# EAGLE design shift_regs (EAGLE 6.1)

## Sheet 1 of 3
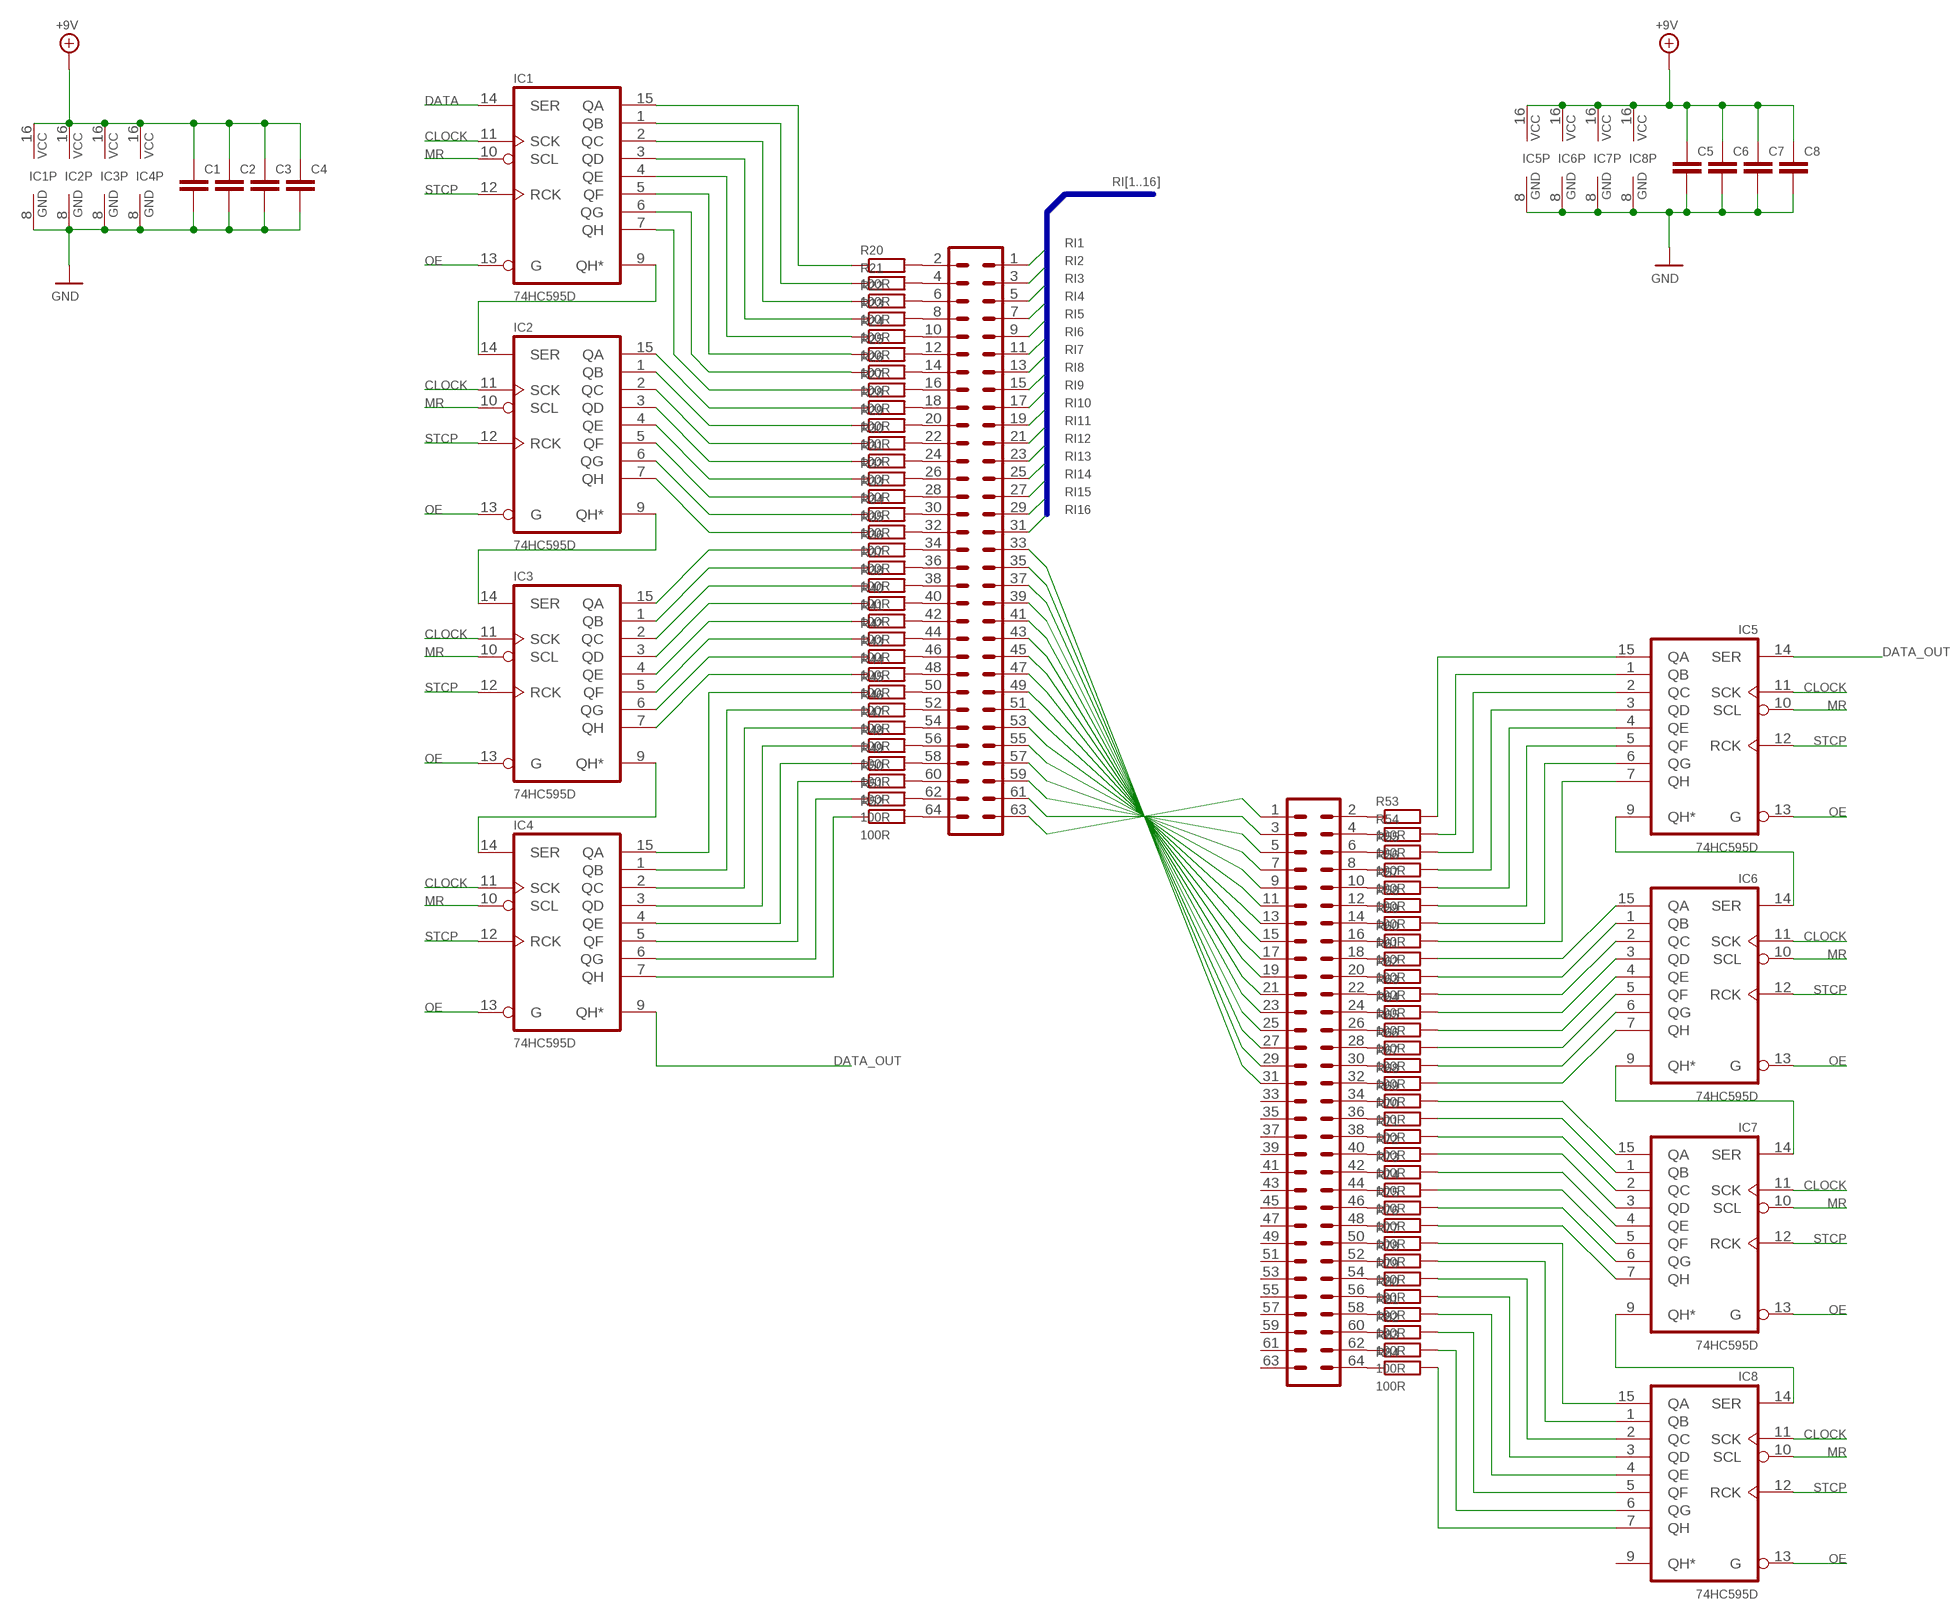
[diagram p0: schematic, sheet 1]

### Parts
C1  C-EUC0805  [C0805]
C2  C-EUC0805  [C0805]
C3  C-EUC0805  [C0805]
C4  C-EUC0805  [C0805]
C5  C-EUC0805  [C0805]
C6  C-EUC0805  [C0805]
C7  C-EUC0805  [C0805]
C8  C-EUC0805  [C0805]
IC1  74HC595D  [SO16]
IC2  74HC595D  [SO16]
IC3  74HC595D  [SO16]
IC4  74HC595D  [SO16]
IC5  74HC595D  [SO16]
IC6  74HC595D  [SO16]
IC7  74HC595D  [SO16]
IC8  74HC595D  [SO16]
R20  100R  R-EU_R0805  [R0805]
R21  100R  R-EU_R0805  [R0805]
R22  100R  R-EU_R0805  [R0805]
R23  100R  R-EU_R0805  [R0805]
R24  100R  R-EU_R0805  [R0805]
R25  100R  R-EU_R0805  [R0805]
R26  100R  R-EU_R0805  [R0805]
R27  100R  R-EU_R0805  [R0805]
R28  100R  R-EU_R0805  [R0805]
R29  100R  R-EU_R0805  [R0805]
R30  100R  R-EU_R0805  [R0805]
R31  100R  R-EU_R0805  [R0805]
R32  100R  R-EU_R0805  [R0805]
R33  100R  R-EU_R0805  [R0805]
R34  100R  R-EU_R0805  [R0805]
R35  100R  R-EU_R0805  [R0805]
R36  100R  R-EU_R0805  [R0805]
R37  100R  R-EU_R0805  [R0805]
R38  100R  R-EU_R0805  [R0805]
R40  100R  R-EU_R0805  [R0805]
R41  100R  R-EU_R0805  [R0805]
R42  100R  R-EU_R0805  [R0805]
R43  100R  R-EU_R0805  [R0805]
R44  100R  R-EU_R0805  [R0805]
R45  100R  R-EU_R0805  [R0805]
R46  100R  R-EU_R0805  [R0805]
R47  100R  R-EU_R0805  [R0805]
R48  100R  R-EU_R0805  [R0805]
R49  100R  R-EU_R0805  [R0805]
R50  100R  R-EU_R0805  [R0805]
R51  100R  R-EU_R0805  [R0805]
R52  100R  R-EU_R0805  [R0805]
R53  100R  R-EU_R0805  [R0805]
R54  100R  R-EU_R0805  [R0805]
R55  100R  R-EU_R0805  [R0805]
R56  100R  R-EU_R0805  [R0805]
R57  100R  R-EU_R0805  [R0805]
R58  100R  R-EU_R0805  [R0805]
R59  100R  R-EU_R0805  [R0805]
R60  100R  R-EU_R0805  [R0805]
R61  100R  R-EU_R0805  [R0805]
R62  100R  R-EU_R0805  [R0805]
R63  100R  R-EU_R0805  [R0805]
R64  100R  R-EU_R0805  [R0805]
R65  100R  R-EU_R0805  [R0805]
R66  100R  R-EU_R0805  [R0805]
R67  100R  R-EU_R0805  [R0805]
R68  100R  R-EU_R0805  [R0805]
R69  100R  R-EU_R0805  [R0805]
R70  100R  R-EU_R0805  [R0805]
R71  100R  R-EU_R0805  [R0805]
R72  100R  R-EU_R0805  [R0805]
R73  100R  R-EU_R0805  [R0805]
R74  100R  R-EU_R0805  [R0805]
R75  100R  R-EU_R0805  [R0805]
R76  100R  R-EU_R0805  [R0805]
R77  100R  R-EU_R0805  [R0805]
R78  100R  R-EU_R0805  [R0805]
R79  100R  R-EU_R0805  [R0805]
R80  100R  R-EU_R0805  [R0805]
R81  100R  R-EU_R0805  [R0805]
R82  100R  R-EU_R0805  [R0805]
R83  100R  R-EU_R0805  [R0805]
R84  100R  R-EU_R0805  [R0805]
SV1  ML64  [ML64]
SV2  ML64  [ML64]

### Nets
+9V: C1.1 C2.1 C3.1 C4.1 C5.1 C6.1 C7.1 C8.1 IC1.16(VCC) IC2.16(VCC) IC3.16(VCC) IC4.16(VCC) IC5.16(VCC) IC6.16(VCC) IC7.16(VCC) IC8.16(VCC) ; also sheet 3
CLOCK: IC1.11(SCK) IC2.11(SCK) IC3.11(SCK) IC4.11(SCK) IC5.11(SCK) IC6.11(SCK) IC7.11(SCK) IC8.11(SCK) ; also sheet 3
DATA: IC1.14(SER) ; also sheet 3
DATA_OUT: IC4.9(QH*) IC5.14(SER)
GND: C1.2 C2.2 C3.2 C4.2 C5.2 C6.2 C7.2 C8.2 IC1.8(GND) IC2.8(GND) IC3.8(GND) IC4.8(GND) IC5.8(GND) IC6.8(GND) IC7.8(GND) IC8.8(GND) ; also sheet 2,3
MR: IC1.10(SCL) IC2.10(SCL) IC3.10(SCL) IC4.10(SCL) IC5.10(SCL) IC6.10(SCL) IC7.10(SCL) IC8.10(SCL) ; also sheet 3
N$1: IC1.9(QH*) IC2.14(SER)
N$2: IC2.9(QH*) IC3.14(SER)
N$3: IC3.9(QH*) IC4.14(SER)
N$5: IC1.1(QB) R21.1
N$6: IC1.2(QC) R22.1
N$7: IC1.3(QD) R23.1
N$8: IC1.4(QE) R24.1
N$9: IC1.5(QF) R25.1
N$10: IC1.6(QG) R26.1
N$11: IC1.7(QH) R27.1
N$12: IC1.15(QA) R20.1
N$13: IC2.1(QB) R29.1
N$14: IC2.2(QC) R30.1
N$15: IC2.3(QD) R31.1
N$16: IC2.4(QE) R32.1
N$17: IC2.5(QF) R33.1
N$18: IC2.6(QG) R34.1
N$19: IC2.7(QH) R35.1
N$20: IC2.15(QA) R28.1
N$21: IC3.1(QB) R37.1
N$22: IC3.2(QC) R38.1
N$23: IC3.3(QD) R40.1
N$24: IC3.4(QE) R41.1
N$25: IC3.5(QF) R42.1
N$26: IC3.6(QG) R43.1
N$27: IC3.7(QH) R44.1
N$28: IC3.15(QA) R36.1
N$29: R20.2 SV1.2
N$30: R21.2 SV1.4
N$31: R22.2 SV1.6
N$32: R23.2 SV1.8
N$33: R24.2 SV1.10
N$34: R25.2 SV1.12
N$35: R26.2 SV1.14
N$36: R27.2 SV1.16
N$37: IC5.9(QH*) IC6.14(SER)
N$38: IC6.9(QH*) IC7.14(SER)
N$39: IC7.9(QH*) IC8.14(SER)
N$40: IC5.1(QB) R54.2
N$41: IC5.2(QC) R55.2
N$42: IC5.3(QD) R56.2
N$43: IC5.4(QE) R57.2
N$44: IC5.5(QF) R58.2
N$45: IC5.6(QG) R59.2
N$46: IC5.7(QH) R60.2
N$47: IC5.15(QA) R53.2
N$48: IC6.1(QB) R62.2
N$49: IC6.2(QC) R63.2
N$50: IC6.3(QD) R64.2
N$51: IC6.4(QE) R65.2
N$52: IC6.5(QF) R66.2
N$53: IC6.6(QG) R67.2
N$54: IC6.7(QH) R68.2
N$55: IC6.15(QA) R61.2
N$56: IC7.1(QB) R70.2
N$57: IC7.2(QC) R71.2
N$58: IC7.3(QD) R72.2
N$59: IC7.4(QE) R73.2
N$60: IC7.5(QF) R74.2
N$61: IC7.6(QG) R75.2
N$62: IC7.7(QH) R76.2
N$63: IC7.15(QA) R69.2
N$64: IC8.15(QA) R77.2
N$65: IC8.1(QB) R78.2
N$66: IC8.2(QC) R79.2
N$67: IC8.3(QD) R80.2
N$68: IC8.4(QE) R81.2
N$69: IC8.5(QF) R82.2
N$70: IC8.6(QG) R83.2
N$71: IC8.7(QH) R84.2
N$72: SV1.63 SV2.1
N$73: SV1.61 SV2.3
N$74: SV1.59 SV2.5
N$75: SV1.57 SV2.7
N$76: SV1.55 SV2.9
N$77: SV1.53 SV2.11
N$78: SV1.51 SV2.13
N$79: SV1.49 SV2.15
N$80: SV1.47 SV2.17
N$81: SV1.45 SV2.19
N$82: SV1.43 SV2.21
N$83: SV1.41 SV2.23
N$84: SV1.39 SV2.25
N$85: SV1.37 SV2.27
N$86: SV1.35 SV2.29
N$87: SV1.33 SV2.31
N$92: R28.2 SV1.18
N$93: R29.2 SV1.20
N$94: R30.2 SV1.22
N$95: R31.2 SV1.24
N$96: R32.2 SV1.26
N$97: R33.2 SV1.28
N$98: R34.2 SV1.30
N$99: R35.2 SV1.32
N$100: R36.2 SV1.34
N$101: R37.2 SV1.36
N$102: R38.2 SV1.38
N$103: R40.2 SV1.40
N$104: R41.2 SV1.42
N$105: R42.2 SV1.44
N$106: R43.2 SV1.46
N$107: R44.2 SV1.48
N$108: R45.2 SV1.50
N$109: R46.2 SV1.52
N$110: R47.2 SV1.54
N$111: R48.2 SV1.56
N$112: R49.2 SV1.58
N$113: R50.2 SV1.60
N$114: R51.2 SV1.62
N$115: R52.2 SV1.64
N$116: R53.1 SV2.2
N$117: R54.1 SV2.4
N$118: R55.1 SV2.6
N$119: IC4.15(QA) R45.1
N$120: IC4.1(QB) R46.1
N$121: IC4.2(QC) R47.1
N$122: IC4.3(QD) R48.1
N$123: IC4.4(QE) R49.1
N$124: IC4.5(QF) R50.1
N$125: IC4.6(QG) R51.1
N$126: IC4.7(QH) R52.1
N$127: R56.1 SV2.8
N$128: R57.1 SV2.10
N$129: R58.1 SV2.12
N$130: R59.1 SV2.14
N$131: R60.1 SV2.16
N$132: R61.1 SV2.18
N$133: R62.1 SV2.20
N$134: R63.1 SV2.22
N$135: R64.1 SV2.24
N$136: R65.1 SV2.26
N$137: R66.1 SV2.28
N$138: R67.1 SV2.30
N$158: R68.1 SV2.32
N$159: R69.1 SV2.34
N$160: R70.1 SV2.36
N$161: R71.1 SV2.38
N$162: R72.1 SV2.40
N$163: R73.1 SV2.42
N$164: R74.1 SV2.44
N$165: R75.1 SV2.46
N$166: R76.1 SV2.48
N$167: R77.1 SV2.50
N$168: R78.1 SV2.52
N$169: R79.1 SV2.54
N$170: R80.1 SV2.56
N$171: R81.1 SV2.58
N$172: R82.1 SV2.60
N$173: R83.1 SV2.62
N$174: R84.1 SV2.64
OE: IC1.13(G) IC2.13(G) IC3.13(G) IC4.13(G) IC5.13(G) IC6.13(G) IC7.13(G) IC8.13(G) ; also sheet 3
RI1: SV1.1 ; also sheet 2
RI2: SV1.3 ; also sheet 2
RI3: SV1.5 ; also sheet 2
RI4: SV1.7 ; also sheet 2
RI5: SV1.9 ; also sheet 2
RI6: SV1.11 ; also sheet 2
RI7: SV1.13 ; also sheet 2
RI8: SV1.15 ; also sheet 2
RI9: SV1.17 ; also sheet 2
RI10: SV1.19 ; also sheet 2
RI11: SV1.21 ; also sheet 2
RI12: SV1.23 ; also sheet 2
RI13: SV1.25 ; also sheet 2
RI14: SV1.27 ; also sheet 2
RI15: SV1.29 ; also sheet 2
RI16: SV1.31 ; also sheet 2
STCP: IC1.12(RCK) IC2.12(RCK) IC3.12(RCK) IC4.12(RCK) IC5.12(RCK) IC6.12(RCK) IC7.12(RCK) IC8.12(RCK) ; also sheet 3
Unconnected: IC8.9(QH*) SV2.33 SV2.35 SV2.37 SV2.39 SV2.41 SV2.43 SV2.45 SV2.47 SV2.49 SV2.51 SV2.53 SV2.55 SV2.57 SV2.59 SV2.61 SV2.63

### Buses
RI[1..16]

## Sheet 2 of 3
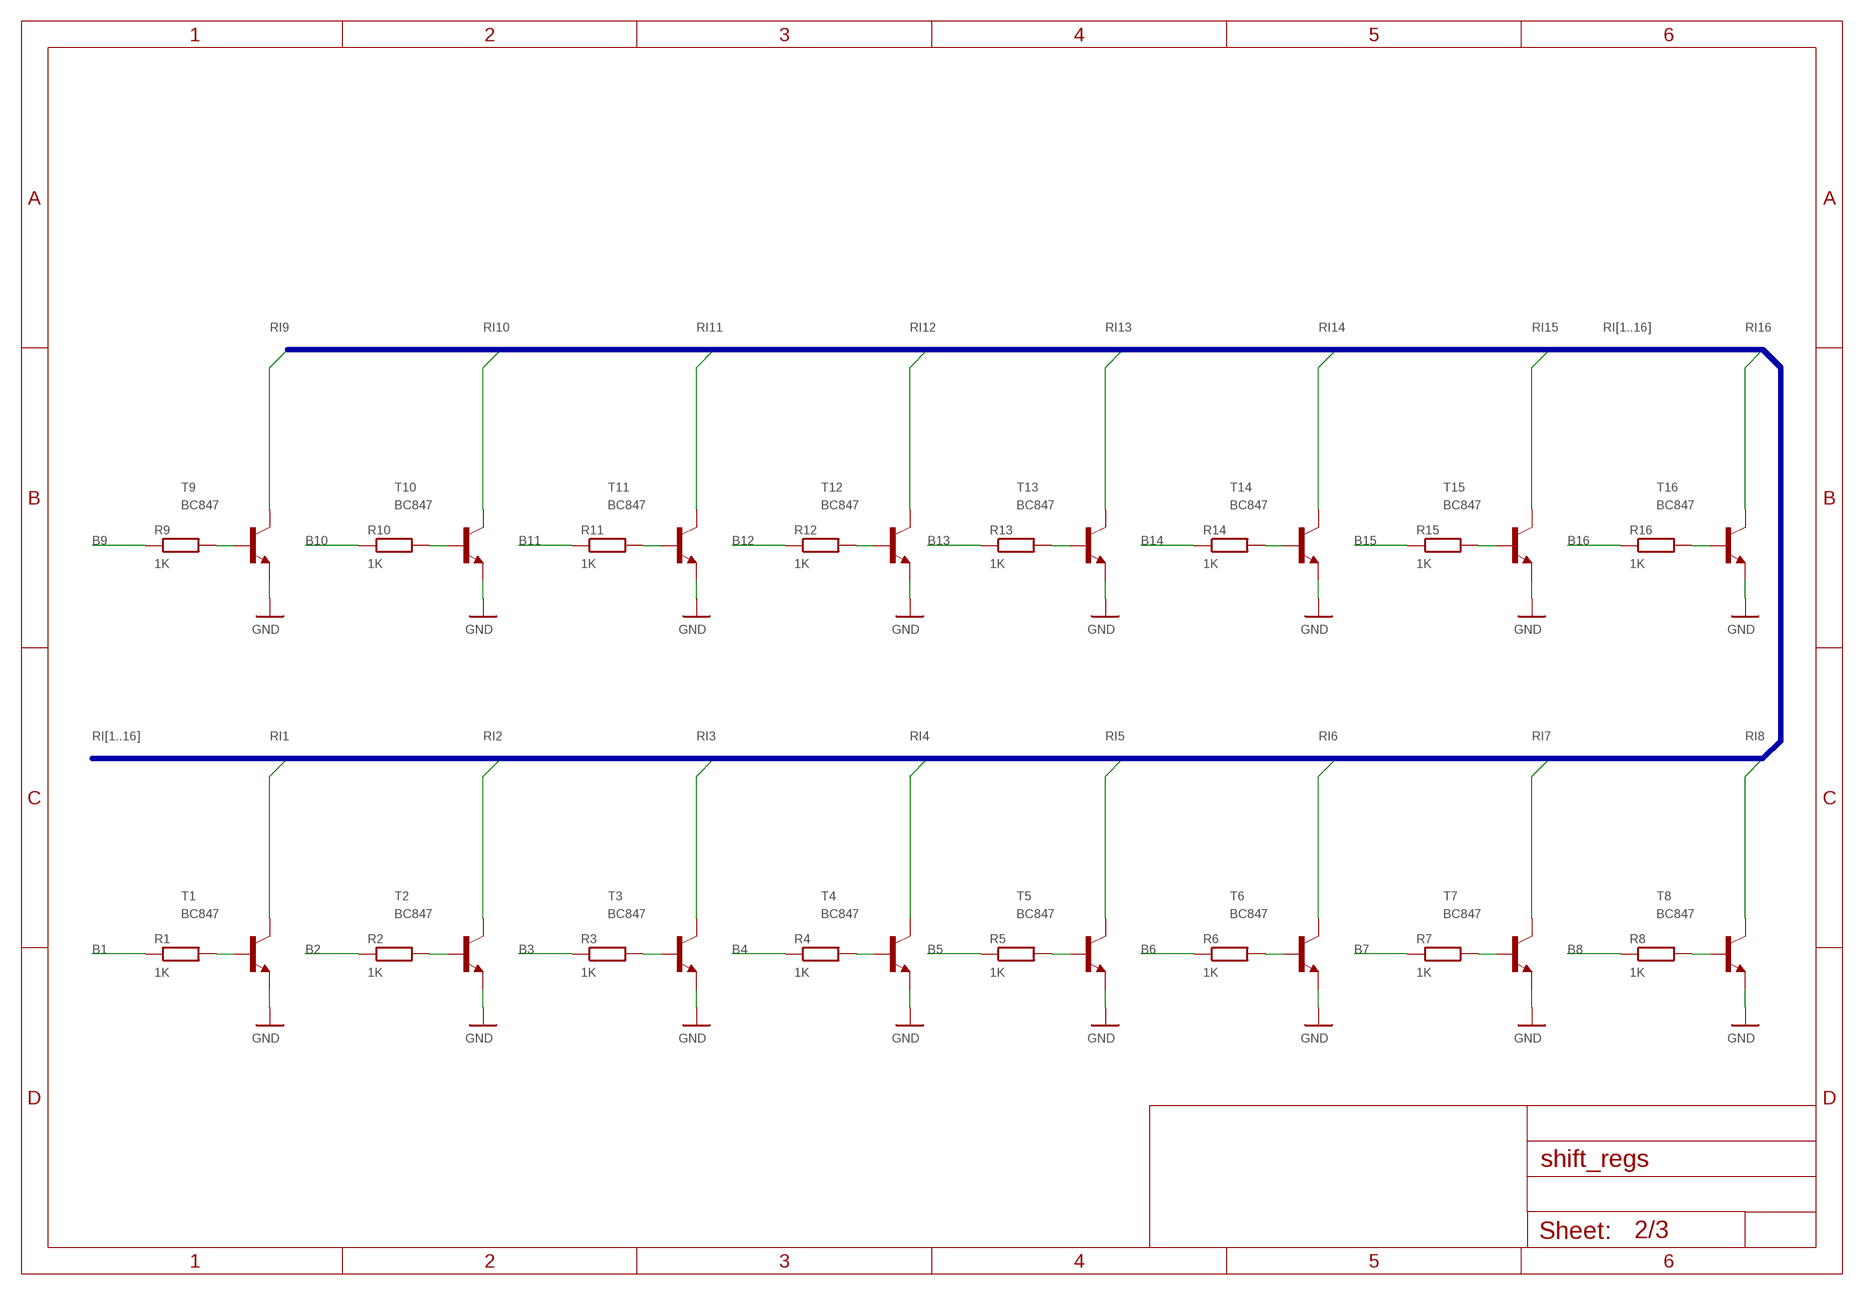
[diagram p1: schematic, sheet 2]

### Parts
R1  1K  R-EU_R0805  [R0805]
R2  1K  R-EU_R0805  [R0805]
R3  1K  R-EU_R0805  [R0805]
R4  1K  R-EU_R0805  [R0805]
R5  1K  R-EU_R0805  [R0805]
R6  1K  R-EU_R0805  [R0805]
R7  1K  R-EU_R0805  [R0805]
R8  1K  R-EU_R0805  [R0805]
R9  1K  R-EU_R0805  [R0805]
R10  1K  R-EU_R0805  [R0805]
R11  1K  R-EU_R0805  [R0805]
R12  1K  R-EU_R0805  [R0805]
R13  1K  R-EU_R0805  [R0805]
R14  1K  R-EU_R0805  [R0805]
R15  1K  R-EU_R0805  [R0805]
R16  1K  R-EU_R0805  [R0805]
T1  BC847  [SOT23]
T2  BC847  [SOT23]
T3  BC847  [SOT23]
T4  BC847  [SOT23]
T5  BC847  [SOT23]
T6  BC847  [SOT23]
T7  BC847  [SOT23]
T8  BC847  [SOT23]
T9  BC847  [SOT23]
T10  BC847  [SOT23]
T11  BC847  [SOT23]
T12  BC847  [SOT23]
T13  BC847  [SOT23]
T14  BC847  [SOT23]
T15  BC847  [SOT23]
T16  BC847  [SOT23]

### Nets
B1: R1.1 ; also sheet 3
B2: R2.1 ; also sheet 3
B3: R3.1 ; also sheet 3
B4: R4.1 ; also sheet 3
B5: R5.1 ; also sheet 3
B6: R6.1 ; also sheet 3
B7: R7.1 ; also sheet 3
B8: R8.1 ; also sheet 3
B9: R9.1 ; also sheet 3
B10: R10.1 ; also sheet 3
B11: R11.1 ; also sheet 3
B12: R12.1 ; also sheet 3
B13: R13.1 ; also sheet 3
B14: R14.1 ; also sheet 3
B15: R15.1 ; also sheet 3
B16: R16.1 ; also sheet 3
GND: T1.2(E) T2.2(E) T3.2(E) T4.2(E) T5.2(E) T6.2(E) T7.2(E) T8.2(E) T9.2(E) T10.2(E) T11.2(E) T12.2(E) T13.2(E) T14.2(E) T15.2(E) T16.2(E) ; also sheet 1,3
N$139: R1.2 T1.1(B)
N$141: R2.2 T2.1(B)
N$142: R3.2 T3.1(B)
N$143: R4.2 T4.1(B)
N$144: R5.2 T5.1(B)
N$145: R6.2 T6.1(B)
N$146: R7.2 T7.1(B)
N$147: R8.2 T8.1(B)
N$148: R9.2 T9.1(B)
N$149: R10.2 T10.1(B)
N$150: R11.2 T11.1(B)
N$151: R12.2 T12.1(B)
N$152: R13.2 T13.1(B)
N$153: R14.2 T14.1(B)
N$154: R15.2 T15.1(B)
N$155: R16.2 T16.1(B)
RI1: T1.3(C) ; also sheet 1
RI2: T2.3(C) ; also sheet 1
RI3: T3.3(C) ; also sheet 1
RI4: T4.3(C) ; also sheet 1
RI5: T5.3(C) ; also sheet 1
RI6: T6.3(C) ; also sheet 1
RI7: T7.3(C) ; also sheet 1
RI8: T8.3(C) ; also sheet 1
RI9: T9.3(C) ; also sheet 1
RI10: T10.3(C) ; also sheet 1
RI11: T11.3(C) ; also sheet 1
RI12: T12.3(C) ; also sheet 1
RI13: T13.3(C) ; also sheet 1
RI14: T14.3(C) ; also sheet 1
RI15: T15.3(C) ; also sheet 1
RI16: T16.3(C) ; also sheet 1

### Buses
RI[1..16]

## Sheet 3 of 3
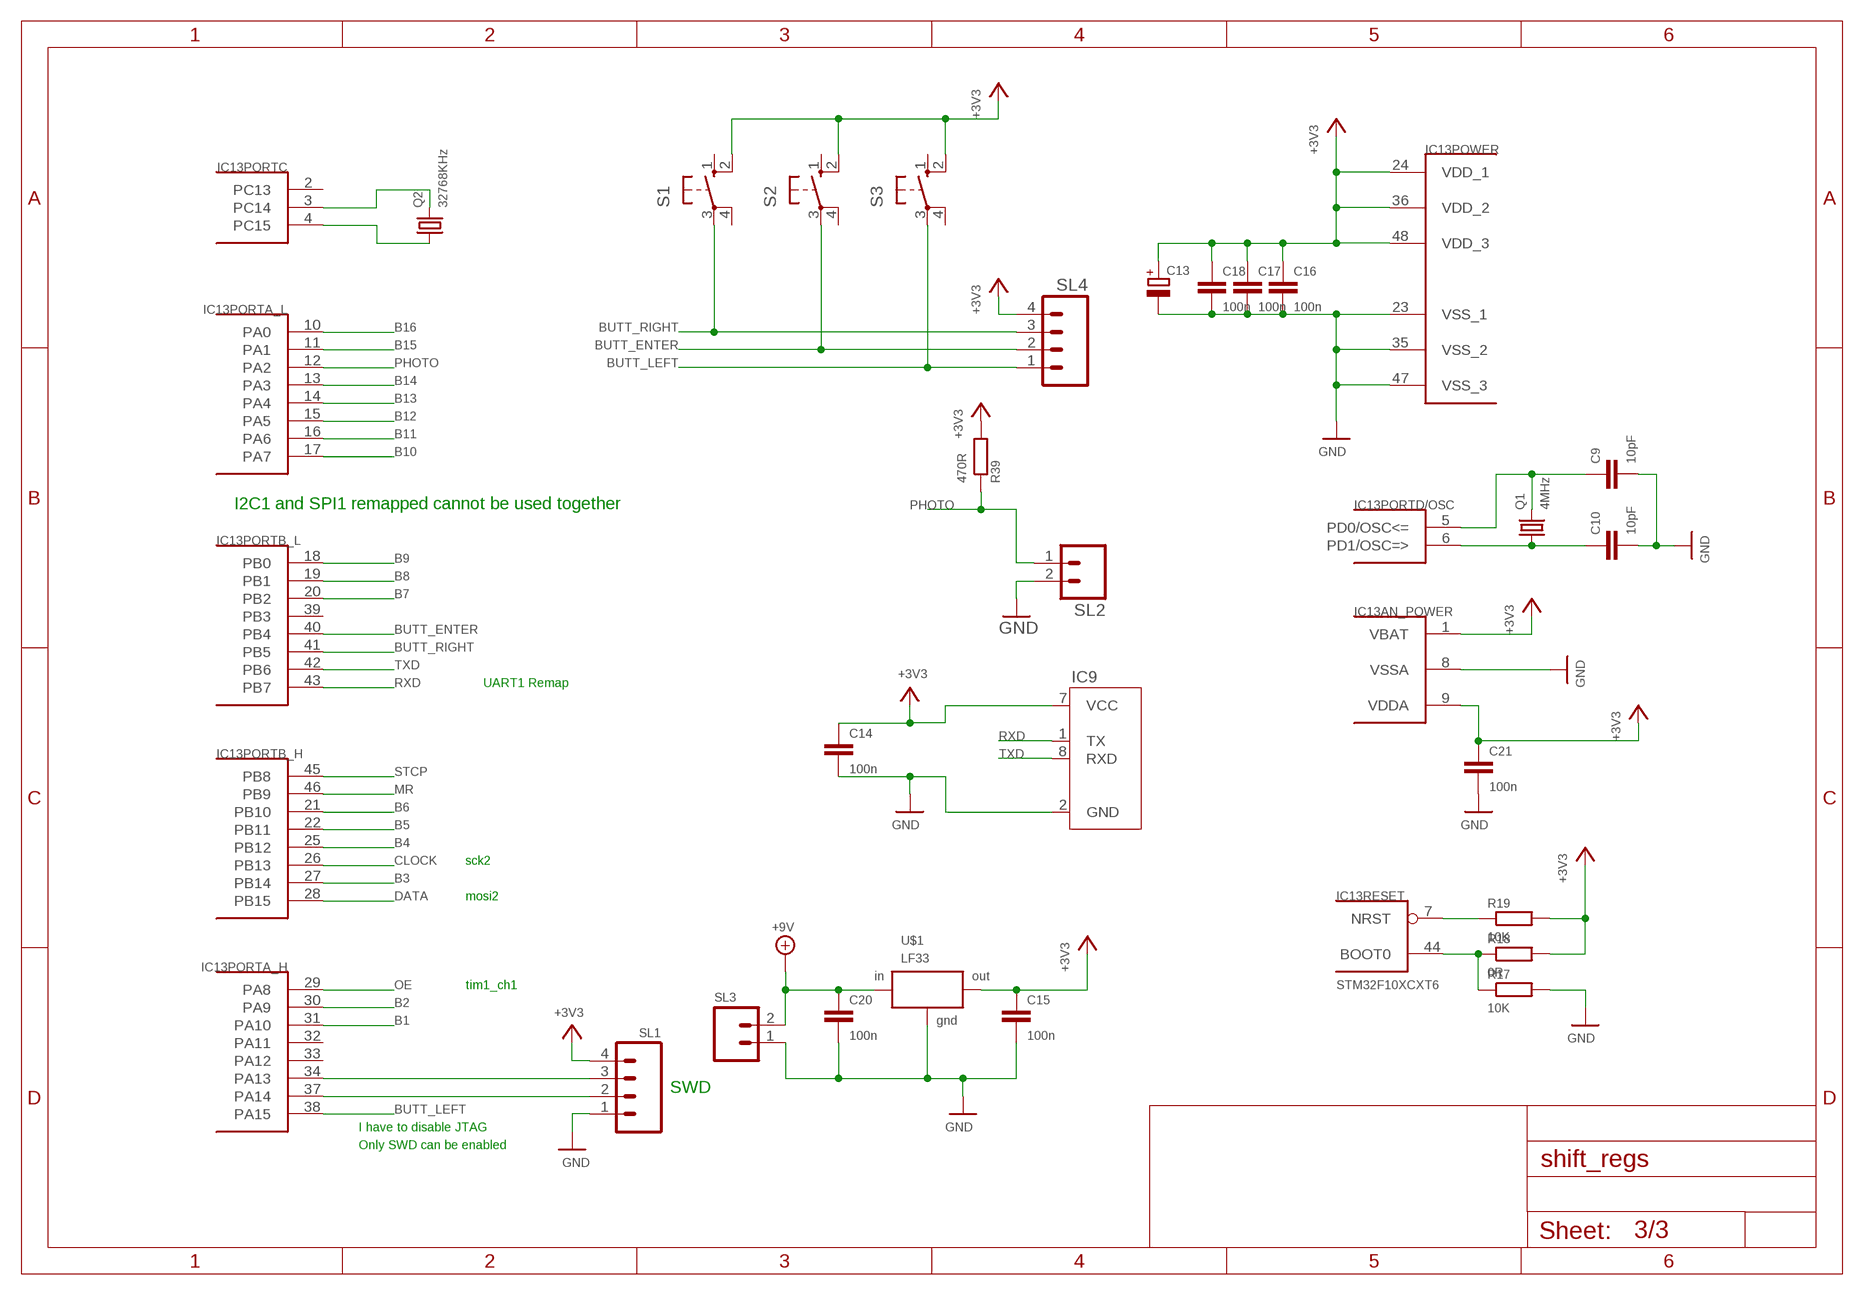
[diagram p2: schematic, sheet 3]

### Parts
C9  10pF  C-EUC0805  [C0805]
C10  10pF  C-EUC0805  [C0805]
C13  CPOL-EUE2.5-6  [E2,5-6]
C14  100n  C-EUC0805  [C0805]
C15  100n  C-EUC0805  [C0805]
C16  100n  C-EUC0805  [C0805]
C17  100n  C-EUC0805  [C0805]
C18  100n  C-EUC0805  [C0805]
C20  100n  C-EUC0805  [C0805]
C21  100n  C-EUC0805  [C0805]
IC9  ESP8266  [NRF24L01]
IC13  STM32F10XCXT6  [TQFP48]
Q1  4MHz  CRYSTALHC49S  [HC49/S]
Q2  32768KHz  CRYSTALTC26V  [TC26V]
R17  10K  R-EU_R0805  [R0805]
R18  0R  R-EU_R0805  [R0805]
R19  10K  R-EU_R0805  [R0805]
R39  470R  R-EU_R0805  [R0805]
S1  10-XX  [B3F-10XX]
S2  10-XX  [B3F-10XX]
S3  10-XX  [B3F-10XX]
SL1  M04  [04P]
SL2  M02  [02P]
SL3  M02  [02P]
SL4  M04  [04P]
U$1  LF33  [DPACK]

### Nets
+3V3: C13.+ C14.1 C15.1 C16.1 C17.1 C18.1 C21.1 IC9.7(VCC) IC13.1(AN_POWER:VBAT) IC13.9(AN_POWER:VDDA) IC13.24(POWER:VDD_1) IC13.36(POWER:VDD_2) IC13.48(POWER:VDD_3) R18.2 R19.2 R39.2 S1.2(S1) S2.2(S1) S3.2(S1) SL1.4 SL4.4 U$1.3(OUT)
+9V: C20.1 SL3.2 U$1.1(IN) ; also sheet 1
B1: IC13.31(PORTA_H:PA10) ; also sheet 2
B2: IC13.30(PORTA_H:PA9) ; also sheet 2
B3: IC13.27(PORTB_H:PB14) ; also sheet 2
B4: IC13.25(PORTB_H:PB12) ; also sheet 2
B5: IC13.22(PORTB_H:PB11) ; also sheet 2
B6: IC13.21(PORTB_H:PB10) ; also sheet 2
B7: IC13.20(PORTB_L:PB2) ; also sheet 2
B8: IC13.19(PORTB_L:PB1) ; also sheet 2
B9: IC13.18(PORTB_L:PB0) ; also sheet 2
B10: IC13.17(PORTA_L:PA7) ; also sheet 2
B11: IC13.16(PORTA_L:PA6) ; also sheet 2
B12: IC13.15(PORTA_L:PA5) ; also sheet 2
B13: IC13.14(PORTA_L:PA4) ; also sheet 2
B14: IC13.13(PORTA_L:PA3) ; also sheet 2
B15: IC13.11(PORTA_L:PA1) ; also sheet 2
B16: IC13.10(PORTA_L:PA0) ; also sheet 2
BUTT_ENTER: IC13.40(PORTB_L:PB4) S2.3(P) SL4.2
BUTT_LEFT: IC13.38(PORTA_H:PA15) S3.3(P) SL4.1
BUTT_RIGHT: IC13.41(PORTB_L:PB5) S1.3(P) SL4.3
CLOCK: IC13.26(PORTB_H:PB13) ; also sheet 1
DATA: IC13.28(PORTB_H:PB15) ; also sheet 1
GND: C9.2 C10.2 C13.- C14.2 C15.2 C16.2 C17.2 C18.2 C20.2 C21.2 IC9.2(GND) IC13.8(AN_POWER:VSSA) IC13.23(POWER:VSS_1) IC13.35(POWER:VSS_2) IC13.47(POWER:VSS_3) R17.2 SL1.1 SL2.2 SL3.1 U$1.2(GND) ; also sheet 1,2
MR: IC13.46(PORTB_H:PB9) ; also sheet 1
N$88: IC13.3(PORTC:PC14) Q2.2
N$89: IC13.4(PORTC:PC15) Q2.1
N$90: C9.1 IC13.5(PORTD/OSC:PD0/OSC<=) Q1.2
N$91: C10.1 IC13.6(PORTD/OSC:PD1/OSC=>) Q1.1
N$140: IC13.44(RESET:BOOT0) R17.1 R18.1
NRST: IC13.7(RESET:NRST) R19.1
OE: IC13.29(PORTA_H:PA8) ; also sheet 1
PHOTO: IC13.12(PORTA_L:PA2) R39.1 SL2.1
RXD: IC9.1(TX) IC13.43(PORTB_L:PB7)
STCP: IC13.45(PORTB_H:PB8) ; also sheet 1
SWDCLK: IC13.37(PORTA_H:PA14) SL1.2
SWDIO: IC13.34(PORTA_H:PA13) SL1.3
TXD: IC9.8(RXD) IC13.42(PORTB_L:PB6)
Unconnected: IC13.2(PORTC:PC13) IC13.32(PORTA_H:PA11) IC13.33(PORTA_H:PA12) IC13.39(PORTB_L:PB3) S1.1(S) S1.4(P1) S2.1(S) S2.4(P1) S3.1(S) S3.4(P1)

### Notes on the sheet
- I2C1 and SPI1 remapped cannot be used together
- UART1 Remap
- sck2
- mosi2
- tim1_ch1
- SWD
- I have to disable JTAG
- Only SWD can be enabled

## Library data of the parts
C1-C10 C14-C18 C20 C21 = rcl:C-EU: CAPACITOR, European symbol
C13 = rcl:CPOL-EU: POLARIZED CAPACITOR, European symbol
IC1-IC8 = 74xx-eu:74*595: 8-bit SHIFT REGISTER, output latch
IC9 = Kuba:ESP8266
IC13 = stm32:STM32F10XCXT6: ST STM32F101/103 48pin LQFP
Q1 Q2 = crystal:CRYSTAL: CRYSTAL
R1-R84 = rcl:R-EU_: RESISTOR, European symbol
S1-S3 = switch-omron:10-XX: OMRON SWITCH
SL1 SL4 = con-amp-quick:M04: AMP QUICK CONNECTOR
SL2 SL3 = con-amp-quick:M02: AMP QUICK CONNECTOR
SV1 SV2 = con-harting-ml:ML64: HARTING
T1-T16 = transistor:BC847: NPN TRANSISTOR
U$1 = custom111027a:LF33: VERY LOW DROP VOLTAGE REGULATORS WITH INHIBIT 3,3V > VERY LOW DROPOUT VOLTAGE (0.45V) > VERY LOW QUIESCENT CURRENT (TYP. > 50 ?A IN OFF MODE, 500 ?A IN ON MODE) > OUTPUT CURRENT UP TO 500 mA > INTERNAL CURRENT AND THERMAL LIMIT > ONLY 2.2 ?F FOR STABILITY > AVAILABLE IN ± 1% (AB) OR ± 2% (C) SELECTION AT 25 °C > SUPPLY VOLTAGE REJECTION: 80db (TYP.) > TEMPERATURE RANGE: -40 TO 125 °C

## Board
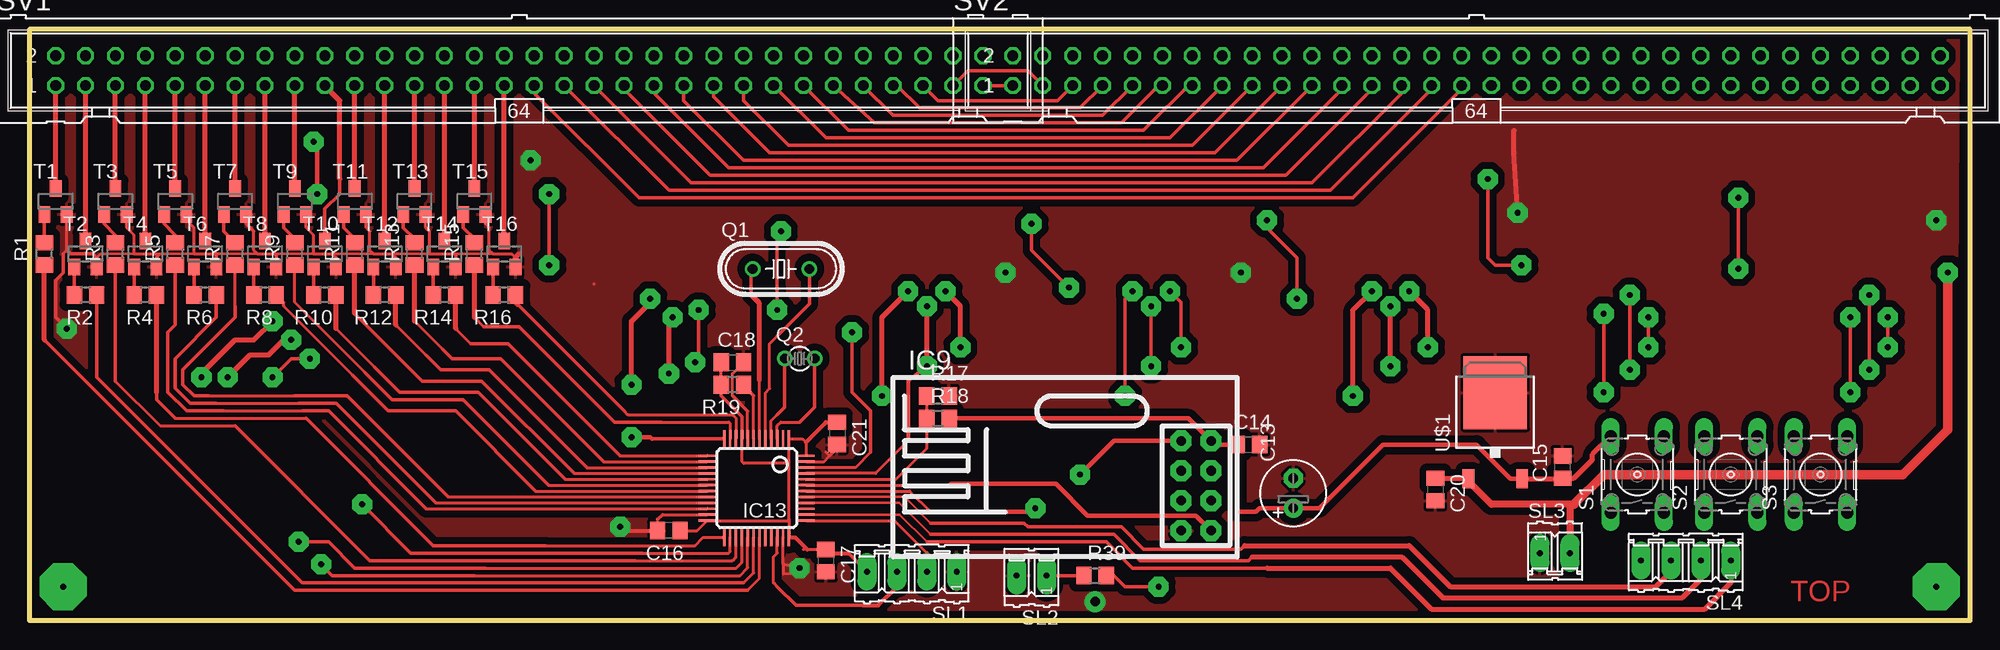
[diagram p3: board, top side]
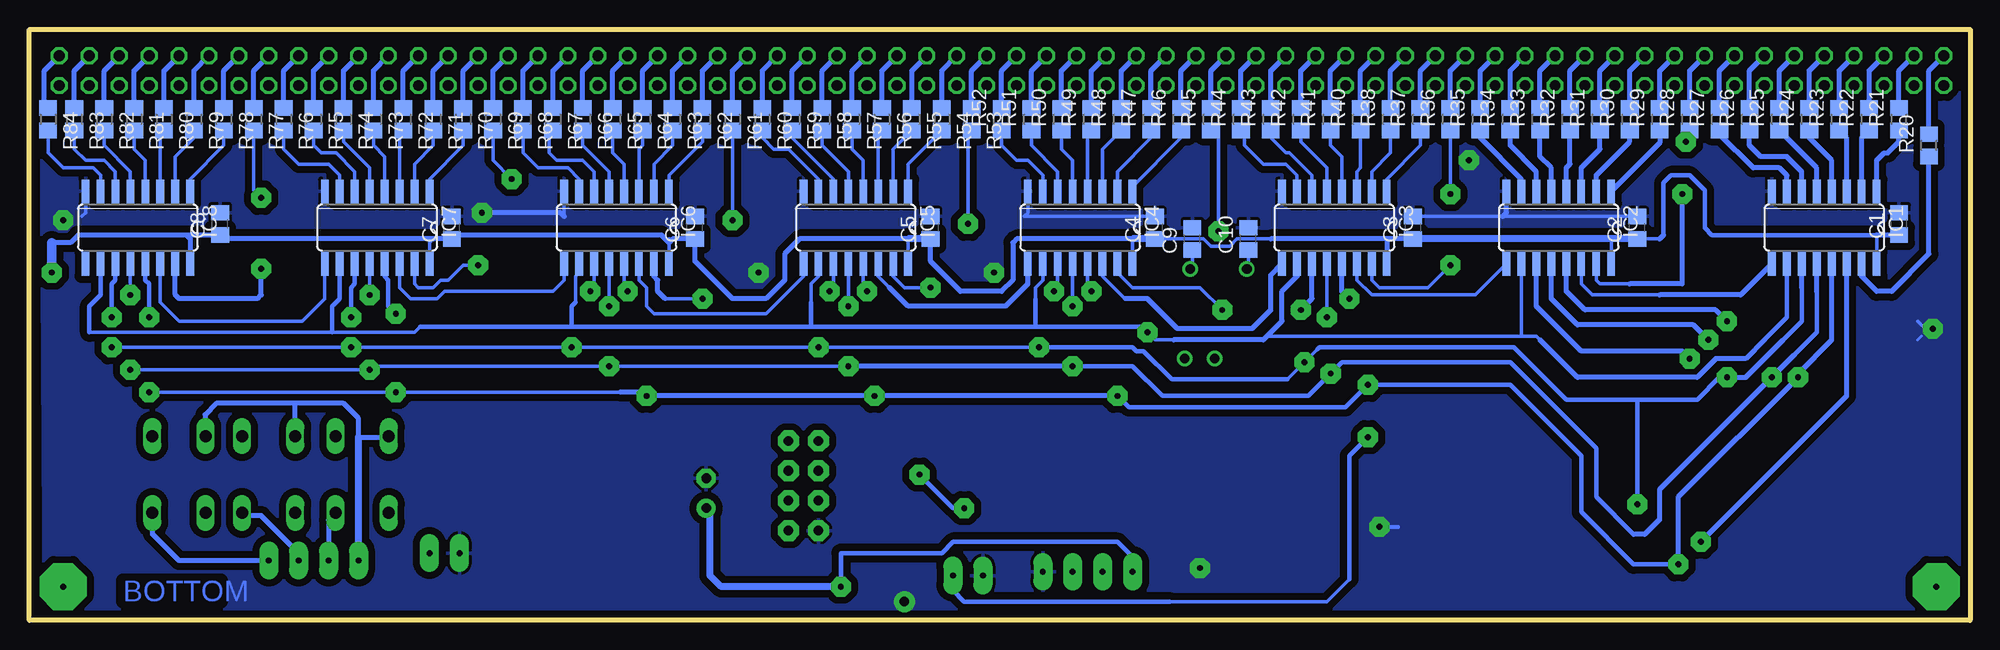
[diagram p4: board, bottom side, seen from below]

Size 164.78 x 50.16 mm. Coordinates in mm from the lower left corner, seen from the top.
Outline: 0,0 164.78,0 164.78,50.17 0,50.17 0,0
Copper layers (1*16): Top 0.035mm / dielectric 1.5mm / Bottom 0.035mm
Design rules: minimum track width 10mil, minimum drill 10mil, track to track 8mil, track to pad 8mil, pad to pad 8mil, via to via 8mil, smd to smd 0mil, copper to edge 10mil, drill to drill 8mil, minimum pad ring 10mil, minimum via ring 8mil, stop-mask expansion 4mil, vias tented up to drill 0mil, thermal gap 10mil

### Footprints (pad centres in the part's own frame; a part is rotated, then mirrored left to right if it is on the bottom)
C0805 = smd 1.3 x 1.5: 1 -0.95,0; 2 0.95,0
E2,5-6 = drill 0.813 pad 1.6: + -1.27,0 | drill 0.813 pad 1.6 octagon: - 1.27,0
SO16 = smd 0.66 x 2.032: 1 -4.445,-3.073; 2 -3.175,-3.073; 3 -1.905,-3.073; 4 -0.635,-3.073; 5 0.635,-3.073; 6 1.905,-3.073; 7 3.175,-3.073; 8 4.445,-3.073; 9 4.445,3.073; 10 3.175,3.073; 11 1.905,3.073; 12 0.635,3.073; 13 -0.635,3.073; 14 -1.905,3.073; 15 -3.175,3.073; 16 -4.445,3.073
NRF24L01 = drill 0.813 pad 1.778 octagon: 1 0,0; 2 -2.54,0; 3 0,2.54; 4 -2.54,2.54; 5 0,5.08; 6 -2.54,5.08; 7 0,7.62; 8 -2.54,7.62
TQFP48 = smd 0.2 x 1.5: 1 -2.75,-4.183; 2 -2.25,-4.183; 3 -1.75,-4.183; 4 -1.25,-4.183; 5 -0.75,-4.183; 6 -0.25,-4.183; 7 0.25,-4.183; 8 0.75,-4.183; 9 1.25,-4.183; 10 1.75,-4.183; 11 2.25,-4.183; 12 2.75,-4.183; 25 2.75,4.183; 26 2.25,4.183; 27 1.75,4.183; 28 1.25,4.183; 29 0.75,4.183; 30 0.25,4.183; 31 -0.25,4.183; 32 -0.75,4.183; 33 -1.25,4.183; 34 -1.75,4.183; 35 -2.25,4.183; 36 -2.75,4.183 | smd 1.5 x 0.2: 13 4.183,-2.75; 14 4.183,-2.25; 15 4.183,-1.75; 16 4.183,-1.25; 17 4.183,-0.75; 18 4.183,-0.25; 19 4.183,0.25; 20 4.183,0.75; 21 4.183,1.25; 22 4.183,1.75; 23 4.183,2.25; 24 4.183,2.75; 37 -4.183,2.75; 38 -4.183,2.25; 39 -4.183,1.75; 40 -4.183,1.25; 41 -4.183,0.75; 42 -4.183,0.25; 43 -4.183,-0.25; 44 -4.183,-0.75; 45 -4.183,-1.25; 46 -4.183,-1.75; 47 -4.183,-2.25; 48 -4.183,-2.75
HC49/S = drill 0.813: 1 -2.413,0; 2 2.413,0
TC26V = drill 0.813: 1 -1.27,0; 2 1.27,0
R0805 = smd 1.3 x 1.5: 1 -0.95,0; 2 0.95,0
B3F-10XX = drill 1.016 long: 1 -3.251,2.261; 2 3.251,2.261; 3 -3.251,-2.261; 4 3.251,-2.261
04P = drill 0.5 pad 1.6 long: 1 -3.81,0; 2 -1.27,0; 3 1.27,0; 4 3.81,0
02P = drill 0.5 pad 1.6 long: 1 -1.27,0; 2 1.27,0
ML64 = drill 0.914 octagon: 1 -39.37,-1.27; 2 -39.37,1.27; 3 -36.83,-1.27; 4 -36.83,1.27; 5 -34.29,-1.27; 6 -34.29,1.27; 7 -31.75,-1.27; 8 -31.75,1.27; 9 -29.21,-1.27; 10 -29.21,1.27; 11 -26.67,-1.27; 12 -26.67,1.27; 13 -24.13,-1.27; 14 -24.13,1.27; 15 -21.59,-1.27; 16 -21.59,1.27; 17 -19.05,-1.27; 18 -19.05,1.27; 19 -16.51,-1.27; 20 -16.51,1.27; 21 -13.97,-1.27; 22 -13.97,1.27; 23 -11.43,-1.27; 24 -11.43,1.27; 25 -8.89,-1.27; 26 -8.89,1.27; 27 -6.35,-1.27; 28 -6.35,1.27; 29 -3.81,-1.27; 30 -3.81,1.27; 31 -1.27,-1.27; 32 -1.27,1.27; 33 1.27,-1.27; 34 1.27,1.27; 35 3.81,-1.27; 36 3.81,1.27; 37 6.35,-1.27; 38 6.35,1.27; 39 8.89,-1.27; 40 8.89,1.27; 41 11.43,-1.27; 42 11.43,1.27; 43 13.97,-1.27; 44 13.97,1.27; 45 16.51,-1.27; 46 16.51,1.27; 47 19.05,-1.27; 48 19.05,1.27; 49 21.59,-1.27; 50 21.59,1.27; 51 24.13,-1.27; 52 24.13,1.27; 53 26.67,-1.27; 54 26.67,1.27; 55 29.21,-1.27; 56 29.21,1.27; 57 31.75,-1.27; 58 31.75,1.27; 59 34.29,-1.27; 60 34.29,1.27; 61 36.83,-1.27; 62 36.83,1.27; 63 39.37,-1.27; 64 39.37,1.27
SOT23 = smd 1 x 1.4: 1 -0.95,-1.1; 2 0.95,-1.1; 3 0,1.1
DPACK = smd 1 x 1.6: 1 -2.28,-4.8; 3 2.28,-4.8 | smd 5.4 x 6.2: 2 0,2.5

### Placement (x,y rotation side)
C1  6.03,33.65 90 bottom
C2  28.26,33.34 90 bottom
C3  47.31,33.34 90 bottom
C4  69.22,33.34 90 bottom
C5  88.27,33.34 90 bottom
C6  108.27,33.34 90 bottom
C7  128.91,33.34 90 bottom
C8  148.59,33.65 90 bottom
C9  66.04,32.38 90 bottom
C10  61.28,32.38 90 bottom
C13  107.31,10.79 90 top
C14  103.5,14.92 0 top
C15  130.18,13.02 90 top
C16  54.29,7.62 180 top
C17  67.63,5.08 270 top
C18  59.69,21.91 0 top
C20  119.38,11.11 270 top
C21  68.58,15.87 270 top
IC1  12.38,33.34 180 bottom
IC2  34.92,33.34 180 bottom
IC3  53.98,33.34 180 bottom
IC4  75.56,33.34 180 bottom
IC5  94.61,33.34 180 bottom
IC6  114.94,33.34 180 bottom
IC7  135.25,33.34 180 bottom
IC8  155.57,33.34 180 bottom
IC9  100.33,7.62 0 top
IC13  61.74,11.23 180 top
Q1  63.82,29.85 0 top
Q2  65.41,22.23 0 top
R1  1.27,31.12 90 top
R2  4.76,27.62 180 top
R3  7.3,31.12 90 top
R4  9.84,27.62 180 top
R5  12.38,31.12 90 top
R6  14.92,27.62 180 top
R7  17.46,31.12 90 top
R8  20,27.62 180 top
R9  22.54,31.12 90 top
R10  25.08,27.62 180 top
R11  27.62,31.12 90 top
R12  30.16,27.62 180 top
R13  32.7,31.12 90 top
R14  35.24,27.62 180 top
R15  37.78,31.12 90 top
R16  40.32,27.62 180 top
R17  77.15,19.05 0 top
R18  77.15,17.14 0 top
R19  59.69,20 180 top
R20  3.49,40.32 90 bottom
R21  6.03,42.54 90 bottom
R22  8.57,42.54 90 bottom
R23  11.11,42.54 90 bottom
R24  13.65,42.54 90 bottom
R25  16.19,42.54 90 bottom
R26  18.73,42.54 90 bottom
R27  21.27,42.54 90 bottom
R28  23.81,42.54 90 bottom
R29  26.35,42.54 90 bottom
R30  28.89,42.54 90 bottom
R31  31.43,42.54 90 bottom
R32  33.97,42.54 90 bottom
R33  36.51,42.54 90 bottom
R34  39.05,42.54 90 bottom
R35  41.59,42.54 90 bottom
R36  44.13,42.54 90 bottom
R37  46.67,42.54 90 bottom
R38  49.21,42.54 90 bottom
R39  90.49,3.81 0 top
R40  51.75,42.54 90 bottom
R41  54.29,42.54 90 bottom
R42  56.83,42.54 90 bottom
R43  59.37,42.54 90 bottom
R44  61.91,42.54 90 bottom
R45  64.45,42.54 90 bottom
R46  66.99,42.54 90 bottom
R47  69.53,42.54 90 bottom
R48  72.07,42.54 90 bottom
R49  74.61,42.54 90 bottom
R50  77.15,42.54 90 bottom
R51  79.69,42.54 90 bottom
R52  82.23,42.54 90 bottom
R53  84.77,42.54 270 bottom
R54  87.31,42.54 270 bottom
R55  89.85,42.54 270 bottom
R56  92.39,42.54 270 bottom
R57  94.93,42.54 270 bottom
R58  97.47,42.54 270 bottom
R59  100.01,42.54 270 bottom
R60  102.55,42.54 270 bottom
R61  105.09,42.54 270 bottom
R62  107.63,42.54 270 bottom
R63  110.17,42.54 270 bottom
R64  112.71,42.54 270 bottom
R65  115.25,42.54 270 bottom
R66  117.79,42.54 270 bottom
R67  120.33,42.54 270 bottom
R68  122.87,42.54 270 bottom
R69  125.41,42.54 270 bottom
R70  127.95,42.54 270 bottom
R71  130.49,42.54 270 bottom
R72  133.03,42.54 270 bottom
R73  135.57,42.54 270 bottom
R74  138.11,42.54 270 bottom
R75  140.65,42.54 270 bottom
R76  143.19,42.54 270 bottom
R77  145.73,42.54 270 bottom
R78  148.27,42.54 270 bottom
R79  150.81,42.54 270 bottom
R80  153.35,42.54 270 bottom
R81  155.89,42.54 270 bottom
R82  158.43,42.54 270 bottom
R83  160.97,42.54 270 bottom
R84  163.19,42.54 270 bottom
S1  136.53,12.38 90 top
S2  144.46,12.38 90 top
S3  152.08,12.38 90 top
SL1  74.93,4.13 180 top
SL2  85.09,3.81 180 top
SL3  129.54,5.71 0 top
SL4  140.65,5.08 180 top
SV1  41.59,46.67 0 top
SV2  122.87,46.67 0 top
T1  2.22,35.56 0 top
T2  4.76,31.12 0 top
T3  7.3,35.56 0 top
T4  9.84,31.12 0 top
T5  12.38,35.56 0 top
T6  14.92,31.12 0 top
T7  17.46,35.56 0 top
T8  20,31.12 0 top
T9  22.54,35.56 0 top
T10  25.08,31.12 0 top
T11  27.62,35.56 0 top
T12  30.16,31.12 0 top
T13  32.7,35.56 0 top
T14  35.24,31.12 0 top
T15  37.78,35.56 0 top
T16  40.32,31.12 0 top
U$1  124.46,16.83 0 top

### Tracks (layer width: path | path; a pad name or v marks a point on that pad's centre or on a via)
+3V3  (via drill 0.5 pad 1.7)
  Top 0.25: R19.2 C18.1
  Top 0.254: C16.1 56.7,7.62 IC13.24 64.4,8.48 64.49,8.57 | 64.71,7.05 IC13.36 64.49,8.57 | IC13.48 65.92,15.12 65.64,15.41 IC13.1 64.49,13.33 | 64.49,8.57 64.49,13.33 | IC13.9 60.49,13.49 60.64,13.33 64.49,13.33 | 65.72,6.03 66.04,6.03 C17.1 67.94,5.71
  Top 0.305: R39.2 92.07,3.81 93.03,2.86 v95.89,2.86 | 69.53,5.71 SL1.4 | IC13.9 60.49,17.3 58.74,19.05 R19.2
  Top 0.328: 64.71,7.05 65.03,7.05 66.04,6.03 | 67.94,5.71 69.53,5.71 | 65.92,15.12 67.63,16.83 68.89,16.83 C21.1
  Top 0.4: U$1.3 125.77,12.03 122.87,14.92 114.94,14.92 109.54,9.52 C13.+ 104.46,9.52 104.14,9.21 102.56,9.21 C14.1 100.64,14.92 IC9.7 98.42,17.14 R18.2
  Top 0.406: U$1.3 130.13,12.03 C15.1 131.13,12.07 132.72,13.65 132.72,14.08 S1.2
  Bottom 0.4: SL1.4 71.12,5.4 72.39,6.67 86.36,6.67 87.31,5.71 95.89,5.71 v95.89,2.86
  Bottom 0.406: S3.2 149.75,15.56 | 136.84,15.56 134.3,15.56 | 134.3,15.56 133.99,15.56 | S1.2 134.3,15.6 134.3,15.56 | S2.2 142.28,15.56
  Bottom 0.408: 136.84,15.56 136.84,17.14 138.11,18.42 142.24,18.42 | 142.24,18.42 148.91,18.42 149.86,17.46 149.86,15.67 S3.2 | S2.2 142.2,18.38 142.24,18.42
  Bottom 0.61: SL4.4 136.84,15.56 | v95.89,2.86 106.05,2.86 107,3.81 107,9.21 C13.+
+9V  (via drill 0.5 pad 1.7)
  Top 0.406: U$1.1 119.42,12.03 C20.1
  Top 0.61: 130.81,9.84 SL3.2 130.81,5.4 | 131.13,9.84 130.81,9.84 | 130.81,9.84 124.14,9.84 122.08,11.91 | 122.08,11.91 121.92,12.07 122.24,12.07 | U$1.1 122.18,12.01 122.08,11.91
  Top 0.8: 162.88,20.96 162.88,16.19 | 122.24,11.97 U$1.1
  Top 0.813: v162.88,29.53 162.88,20.96 | 162.88,16.19 159.07,12.38 133.67,12.38 131.13,9.84
  Bottom 0.305: 7.94,32.7 IC1.16 | 71.12,32.39 IC4.16 | 110.49,32.39 110.49,32.07 IC6.16 | 30.48,32.39 IC2.16 | 26.35,32.39 C2.1 | 90.17,32.39 IC5.16 | IC7.16 130.81,32.07 130.49,32.39 | 59.37,32.39 62.23,32.39 62.87,31.75 64.45,31.75 65.09,32.39 C4.1
  Bottom 0.4: 26.04,32.7 26.04,37.15 25.4,37.78 23.81,37.78 22.54,36.51 22.54,33.34 21.91,32.7 7.94,32.7
  Bottom 0.406: 90.17,32.39 99.38,32.39 100.65,31.12 100.65,28.89 102.23,27.3 105.09,27.3 108.27,30.48 C6.1 110.17,32.39 110.49,32.07 111.12,32.7 128.59,32.7 C7.1 130.49,32.39 148.27,32.39 C8.1 151.45,32.71 | C5.1 88.27,30.48 85.72,27.94 82.23,27.94 81.28,28.89 81.28,32.07 80.96,32.39 71.12,32.39 | C4.1 | 151.45,32.71 160.65,32.71 161.29,32.07 162.56,32.07 162.88,31.75 | IC8.16 151.13,32.39 151.45,32.71 | C1.1 7.94,32.7 | 26.04,32.7 26.35,32.39 | C3.1 49.53,32.39 | 49.53,32.39 IC3.16 | 49.53,32.39 59.37,32.39
  Bottom 0.61: C2.1 30.48,32.39 C3.1 | C4.1 71.12,32.39 | C5.1 90.17,32.39
  Bottom 0.813: v162.88,29.53 162.88,31.75 162.88,32.07
B1
  Top 0.254: IC13.31 61.99,3.57 60.96,2.54
  Top 0.305: 60.96,2.54 22.54,2.54 1.27,23.81
  Top 0.406: 1.27,23.81 R1.1
B2
  Top 0.254: IC13.30 61.49,4.02 60.64,3.18
  Top 0.305: 5.4,27.3 5.71,27.3 R2.1 5.71,20.64 23.18,3.18 60.64,3.18
B3
  Top 0.254: IC13.27 59.99,5.38 59.69,5.08 51.44,5.08 | 17.46,16.51 11.11,16.51 7.3,20.32
  Top 0.305: 7.3,20.32 R3.1 | 51.44,5.08 28.89,5.08 17.46,16.51
B4
  Top 0.254: IC13.25 57.21,7.05 56.52,6.35 43.81,6.35 | R4.1 | 12.38,17.14 23.5,17.14
  Top 0.305: 12.38,17.14 10.79,18.73 10.79,19.37 | 43.81,6.35 34.29,6.35 23.5,17.14
  Top 0.406: 10.79,19.37 R4.1
B5
  Top 0.25: 33.7,9.48 IC13.22
  Top 0.254: 16.51,17.78 23.18,17.78
  Top 0.305: R5.1 12.38,25.08 11.75,24.45 11.75,19.37 13.34,17.78 16.51,17.78 | 23.18,17.78 25.4,17.78 33.7,9.48
B6
  Top 0.25: 34.47,9.98 IC13.21
  Top 0.254: 15.87,26.98 R6.1 | 15.88,18.42 22.86,18.42
  Top 0.305: 15.87,26.98 15.88,26.98 15.88,25.72 12.38,22.23 12.38,19.69 13.65,18.42 15.88,18.42 | 22.86,18.42 26.04,18.42 34.47,9.98
B7
  Top 0.25: 35.56,10.48 IC13.20
  Top 0.254: 17.46,26.67 R7.1 | 15.24,19.05 22.54,19.05
  Top 0.305: 15.24,19.05 13.97,19.05 13.02,20 13.02,21.27 17.46,25.72 17.46,26.67 | 22.54,19.05 26.99,19.05 35.56,10.48
B8
  Top 0.25: 43,10.98 IC13.19
  Top 0.254: 27.75,20.5 27.75,20.51 27.46,20.8 21.59,26.67 21.59,26.98 R8.1
  Top 0.305: 43,10.98 36.2,17.78 30.48,17.78 27.46,20.8
B9
  Top 0.25: 44.08,11.48 IC13.18
  Top 0.254: 28.53,21 22.54,26.99 R9.1
  Top 0.305: 44.08,11.48 36.83,18.73 30.8,18.73 28.53,21
B10
  Top 0.25: 45.49,11.98 IC13.17
  Top 0.254: 29.29,21.5 26.03,24.76
  Top 0.305: 45.49,11.98 38.1,19.37 31.43,19.37 29.29,21.5
  Top 0.406: 26.03,24.76 R10.1
B11
  Top 0.25: 46.26,12.48 IC13.16
  Top 0.305: 46.26,12.48 38.42,20.32 33.34,20.32 27.62,26.03
  Top 0.406: 27.62,26.03 R11.1
B12
  Top 0.25: 47.35,12.98 IC13.15
  Top 0.254: 33.69,22.5 31.11,25.08
  Top 0.305: 47.35,12.98 39.05,21.27 34.92,21.27 33.69,22.5
  Top 0.406: 31.11,25.08 R12.1
B13
  Top 0.25: 48.75,13.48 IC13.14
  Top 0.254: 35.1,23 32.7,25.4
  Top 0.305: 48.75,13.48 40.01,22.23 35.88,22.23 35.1,23
  Top 0.406: 32.7,25.4 R13.1
B14
  Top 0.25: 50.16,13.98 IC13.13
  Top 0.254: 37.45,23.5 36.19,24.76
  Top 0.305: 50.16,13.98 40.64,23.49 37.46,23.49 37.45,23.5
  Top 0.406: 36.19,24.76 R14.1
B15
  Top 0.254: 38.56,24.94 37.78,25.72 | IC13.11 59.49,16.71 59.37,16.83 53.66,16.83
  Top 0.305: 38.56,24.94 41.59,24.94 49.7,16.83 53.66,16.83
  Top 0.406: 37.78,25.72 R15.1
B16
  Top 0.254: IC13.10 59.99,17.16 59.69,17.46 50.8,17.46 50.48,17.78
  Top 0.305: 50.48,17.78 41.43,26.83
  Top 0.406: R16.1 41.27,26.99 41.43,26.83
BUTT_ENTER
  Top 0.2: IC13.40 73.84,9.98 76.52,7.3
  Top 0.305: 76.52,7.3 92.08,7.3 94.3,5.08 103.5,5.08 103.82,5.4
  Top 0.406: 103.82,5.4 116.52,5.4 120.02,1.91 140.34,1.91 141.92,3.49 SL4.2
  Bottom 0.406: SL4.2 141.92,5.71 145.1,8.89 146.48,8.89 S2.3
BUTT_LEFT
  Top 0.2: IC13.38 73.89,8.98 76.2,6.67
  Top 0.305: 76.2,6.67 91.44,6.67 93.66,4.45 105.09,4.45
  Top 0.406: 105.09,4.45 115.57,4.45 119.06,0.95 142.24,0.95 144.46,3.18 SL4.1
  Bottom 0.406: SL4.1 152.08,5.08 154.34,7.34 S3.3
BUTT_RIGHT
  Top 0.2: IC13.41 74.29,10.48 76.52,8.25
  Top 0.305: 76.52,8.25 84.45,8.25 84.77,7.94 92.71,7.94 94.61,6.03 102.87,6.03 103.19,6.35
  Top 0.406: 103.19,6.35 117.16,6.35 120.65,2.86 138.11,2.86 139.38,4.13 SL4.3
  Bottom 0.406: S1.3 139.38,8.53 SL4.3
CLOCK  (via drill 0.5 pad 1.7)
  Top 0.254: IC13.26 59.49,5.83 59.37,5.71 52.07,5.71
  Top 0.305: v23.81,22.23 22.23,22.23 v20.64,20.64 | v157.8,23.18 v157.8,25.72 | v137.48,23.18 v137.48,25.72 | v96.84,27.94 97.79,26.99 v97.79,23.18 | 52.07,5.71 32.38,5.71 v28.26,9.84 | v56.83,26.35 56.83,22.23 v56.52,21.91
  Top 0.406: v77.79,27.94 79.06,26.67 v79.06,23.18 | v118.75,23.18 118.75,26.35 v117.16,27.94
  Bottom 0.305: 14.29,29.21 IC1.11 | 20.95,20.64 v20.64,20.64 | IC4.11 77.47,28.26 v77.79,27.94 | IC5.11 96.52,28.26 v96.84,27.94 | v79.06,23.18 v97.79,23.18 v118.75,23.18 v137.48,23.18 v157.8,23.18 | IC6.11 116.84,28.26 v117.16,27.94 | 55.4,23.02 v56.52,21.91 57.94,20.48
  Bottom 0.4: 55.4,23.02 55.24,23.18 38.73,23.18 34.29,18.73 28.26,18.73 | IC7.11 137.16,28.57 137.48,28.26 v137.48,25.72 | IC8.11 157.48,28.89 157.8,28.57 v157.8,25.72 | 14.29,28.26 14.29,25.4 15.88,23.81 | 20.95,20.64 21.27,20.64 23.18,18.73 28.26,18.73 | v28.26,9.84 28.26,18.73 | 57.94,20.48 67.79,20.48 70.17,22.86 70.8,22.86 71.12,23.18 v79.06,23.18
  Bottom 0.406: IC2.11 36.83,26.67 33.02,22.86 24.45,22.86 v23.81,22.23 | 14.29,28.26 14.29,29.21 | v20.64,20.64 19.05,20.64 15.88,23.81 | IC3.11 55.88,27.3 v56.83,26.35
DATA  (via drill 0.5 pad 1.7)
  Top 0.254: IC13.28 60.49,4.93 60.01,4.45 38.73,4.45
  Top 0.305: 38.73,4.45 27.62,4.45 25.4,6.67 v22.86,6.67
  Bottom 0.406: IC1.14 10.48,19.05 v22.86,6.67
DATA_OUT
  Bottom 0.305: IC5.14 92.71,29.21 91.76,28.26 91.44,27.94 | 80.01,29.21 IC4.9
  Bottom 0.406: 80.01,29.21 80.01,28.57 81.92,26.67 90.17,26.67 91.76,28.26
GND  (via drill 0.5 pad 1.7, 0.8 pad 1.78)
  Top 0.2: 6.03,31.12 8.89,31.12 | 11.11,31.12 13.97,31.12 | 15.88,31.12 19.37,31.12 | 20.95,31.12 24.13,31.12 | 25.72,31.12 29.21,31.12 | 30.8,31.12 33.97,31.12 | 36.2,31.12 39.37,31.12
  Top 0.25: 53.74,8.98 IC13.23 | IC13.8 60.99,17.75 | 59.69,19.05 59.69,20.96 C18.2
  Top 0.254: 63.99,3.96 65.11,4.01 | IC13.47 67.45,13.48 67.94,13.97 | 19.05,33.02 19.05,31.43 19.37,31.12 20.95,31.12 20.95,31.11 T8.2 | T1.2 3.17,31.43 2.86,31.12 | T2.2 5.71,30.8 6.03,31.12 | T4.2 10.79,30.8 11.11,31.12 8.89,31.12 8.89,32.7 8.25,33.34 T3.2 | 15.87,30.48 T6.2 | T5.2 13.33,33.97 13.97,33.34 13.97,31.12 15.88,31.12 | T16.2 41.27,30.8 40.96,31.12 39.37,31.12 39.05,31.43 39.05,33.34 38.73,33.66 T15.2 | T10.2 26.03,30.8 25.72,31.12 24.13,31.12 24.13,32.7 23.49,33.34 T9.2 | T12.2 31.11,30.8 30.8,31.12 29.21,31.12 28.89,31.43 28.89,33.02 28.57,33.34 T11.2 | T14.2 36.19,31.11 36.2,31.12 33.97,31.12 33.97,33.02 33.65,33.34 T13.2 | 67.94,13.97 | 67.94,13.97 67.63,14.28 | 63.99,4.76 IC13.35 | 63.99,4.76 63.99,4.01 | v65.41,4.45 63.99,4.76 | 47.94,28.57
  Top 0.3: 53.34,8.58 53.74,8.98
  Top 0.305: T7.2 18.41,33.66 19.05,33.02 | 15.87,30.48 15.88,30.48 15.88,31.12 | 2.86,31.12 2.86,29.53 2.22,28.89 2.22,25.72 v3.17,24.76 | 5.71,30.16 5.71,30.17 5.71,30.8 5.4,31.12 3.49,31.12 3.17,31.43 | 67.94,13.97 68.58,14.61 C21.2 | 60.99,17.75 59.69,19.05
  Top 0.328: C16.2 50.48,7.62 v50.16,7.94
  Top 0.406: v126.36,34.61 126.05,39.69 126.05,41.59 | T16.2 41.27,30.8 41.59,31.12
  Bottom 0.254: 4.45,23.81 4.13,24.13
  Bottom 0.305: C4.2 80.33,34.29 80.01,34.6 IC4.8 | 119.38,34.29 IC6.8 | C2.2 39.69,34.29 C3.2 | IC8.8 160.02,34.6 160.34,34.29 | v3.17,24.76 3.81,24.76 4.45,25.4
  Bottom 0.328: v50.16,7.94 48.58,7.94
  Bottom 0.406: IC2.8 39.37,34.6 39.69,34.29 | 119.38,34.29 119.7,34.61 v126.36,34.61 | 2.86,24.45 2.54,24.76
  other vias: 161.93,33.97 102.87,29.53 42.55,39.05 82.87,29.53 90.49,1.59
  pour Bottom (isolate 0.6): 0.32,0.95 163.51,0.95 163.83,49.53 0.64,49.53 0.64,12.06
  pour Top (isolate 0.6): 0.32,0.95 163.51,0.95 163.83,49.21 1.27,49.21
MR  (via drill 0.5 pad 1.7)
  Top 0.254: IC13.46 70.13,12.98 71.44,14.29
  Top 0.305: 71.44,14.29 71.44,17.78 69.85,19.37 v69.85,24.45
  Bottom 0.305: IC1.10 15.56,30.48 | IC4.10 78.74,28.89 79.38,28.26 79.38,27.3 | IC5.10 97.79,29.21 98.42,28.57 98.42,26.99 | 118.43,26.99 118.43,29.21 118.11,29.53 IC6.10 | 159.7,24.45 139.06,24.45 132.08,24.45 131.6,24.92 | 38.1,24.13 36.83,24.13 36.51,23.81 | 38.1,24.13 59.69,24.13 | 38.1,24.13 IC2.10 | 67.63,23.81 69.22,23.81 v69.85,24.45
  Bottom 0.4: v69.85,24.45 70.33,24.92 79.38,24.92 | 79.38,24.92 98.42,24.92 | 98.42,24.92 118.75,24.92 | 118.75,24.92 131.6,24.92 | 118.43,26.99 118.75,26.67 118.75,24.92 | 98.42,24.92 98.42,26.99 | 79.38,24.92 79.38,27.3 | IC7.10 138.43,27.3 139.06,26.67 139.06,24.45 | IC8.10 158.75,27.62 159.7,26.67 159.7,24.45 | 17.46,23.81 15.56,25.72 IC1.10
  Bottom 0.406: 36.51,23.81 33.34,20.64 23.18,20.64 21.59,22.23 19.05,22.23 17.46,23.81 | IC3.10 57.15,29.21 58.42,27.94 58.42,25.4 59.69,24.13 60.01,23.81 67.63,23.81
N$1
  Bottom 0.305: IC2.14 33.02,28.57 32.07,27.62 26.35,27.62
  Bottom 0.406: IC1.9 19.47,27.62 26.35,27.62
N$2
  Bottom 0.305: IC3.14 52.07,28.89 50.8,27.62 42.01,27.62 IC2.9
N$3
  Bottom 0.305: 71.75,27.3 73.66,29.21 IC4.14
  Bottom 0.406: 71.75,27.3 69.85,27.3 67.31,24.76 60.96,24.76 59.37,26.35 59.37,29.31 IC3.9
N$4  (via drill 0.5 pad 4)
  other vias: 2.86,2.86
N$5
  Bottom 0.406: IC1.1 7.94,39.05 7.3,39.69 6.99,39.69 6.03,40.64 R21.1
N$6
  Bottom 0.406: IC1.2 9.21,40.96 R22.1
N$7
  Bottom 0.406: IC1.3 10.48,40.96 R23.1
N$8
  Bottom 0.406: IC1.4 11.75,39.05 13.65,40.96 R24.1
N$9
  Bottom 0.406: 15.88,41.28 R25.1 13.02,38.42 IC1.5
N$10
  Bottom 0.406: R26.1 18.73,40.32 17.78,39.37 15.56,39.37 14.29,38.1 IC1.6
N$11
  Bottom 0.406: R27.1 21.27,41.28 18.41,38.42 16.19,38.42 15.56,37.78 IC1.7
N$12
  Bottom 0.406: IC1.15 9.21,29.21 7.94,27.94 6.67,27.94 3.49,31.12 R20.1
N$13
  Bottom 0.406: R29.1 26.35,40.54 IC2.1
N$14
  Bottom 0.406: R30.1 28.89,40.64 31.75,37.78 IC2.2
N$15
  Bottom 0.406: R31.1 31.43,40 33.02,38.42 IC2.3
N$16
  Bottom 0.406: R32.1 33.97,38.74 34.29,38.42 IC2.4
N$17
  Bottom 0.406: R33.1 36.51,39.37 35.56,38.42 IC2.5
N$18
  Bottom 0.406: R34.1 39.05,40.32 36.83,38.1 IC2.6
N$19
  Bottom 0.406: R35.1 41.59,40.96 38.1,37.46 IC2.7
N$20  (via drill 0.5 pad 1.7)
  Top 0.4: v24.13,40.64 24.45,40.32 v24.45,36.2
  Bottom 0.305: IC2.15 31.75,28.89 31.43,28.57 28.89,28.57
  Bottom 0.4: v24.13,40.64 24.13,41.28 R28.1
  Bottom 0.406: 28.89,28.57 24.45,28.57 v24.45,36.2
N$21
  Bottom 0.305: IC3.1 49.53,37.46 46.67,40.32 R37.1
N$22
  Bottom 0.305: R38.1 49.21,39.69 50.8,38.1 IC3.2
N$23
  Bottom 0.305: R40.1 51.75,38.42 52.07,38.1 IC3.3
N$24
  Bottom 0.305: IC3.4 53.34,39.37 54.29,40.32 R41.1
N$25
  Bottom 0.305: IC3.5 54.61,38.42 56.83,40.64 R42.1
N$26
  Bottom 0.305: IC3.6 55.88,37.78 57.78,39.69 58.1,39.69 59.37,40.96 R43.1
N$27
  Bottom 0.305: IC3.7 57.15,37.78 58.1,38.74 60.01,38.74 61.59,40.32 61.59,41.28 R44.1
N$28  (via drill 0.5 pad 1.7)
  Top 0.305: v44.13,30.16 v44.13,36.2
  Bottom 0.305: IC3.15 50.8,28.89 50.16,28.26 46.04,28.26 v44.13,30.16 | v44.13,36.2 R36.1
N$29
  Bottom 0.406: R20.2 3.49,46.67 SV1.2
N$30
  Bottom 0.406: SV1.4 6.03,46.67 R21.2
N$31
  Bottom 0.406: SV1.6 8.57,46.67 R22.2
N$32
  Bottom 0.406: SV1.8 11.11,46.67 R23.2
N$33
  Bottom 0.406: SV1.10 13.65,46.67 R24.2
N$34
  Bottom 0.406: SV1.12 16.19,46.67 R25.2
N$35
  Bottom 0.406: SV1.14 18.73,46.67 R26.2
N$36
  Bottom 0.406: SV1.16 21.27,46.67 R27.2
N$37
  Bottom 0.305: IC5.9 99.06,29.21 102.23,26.03 111.76,26.03 112.39,26.67 112.39,28.26 113.03,28.89 IC6.14
N$38
  Bottom 0.305: IC6.9 119.38,28.89 120.33,27.94 129.54,27.94 130.18,27.3 132.4,27.3 133.35,28.26 IC7.14
N$39
  Bottom 0.305: IC7.9 139.7,27.3 141.6,25.4 152.08,25.4 153.67,26.99 IC8.14
N$40
  Bottom 0.305: IC5.1 90.17,38.74 R54.2
N$41
  Bottom 0.305: IC5.2 91.44,40.01 R55.2
N$42
  Bottom 0.305: IC5.3 92.71,41.28 R56.2
N$43
  Bottom 0.305: IC5.4 93.98,39.05 94.93,40 R57.2
N$44
  Bottom 0.305: IC5.5 95.25,38.1 97.47,40.32 R58.2
N$45
  Bottom 0.305: IC5.6 96.52,37.46 100.01,40.96 R59.2
N$46
  Bottom 0.305: IC5.7 97.79,37.46 100.33,40 101.6,40 102.55,40.96 R60.2
N$47  (via drill 0.5 pad 1.7)
  Top 0.305: v88.27,28.26 85.09,31.43 v85.09,33.65
  Bottom 0.305: IC5.15 91.44,29.21 90.49,28.26 v88.27,28.26 | R53.2 85.09,41.28 v85.09,33.65
N$48
  Bottom 0.305: IC6.1 110.49,37.78 107.63,40.64 R62.2
N$49
  Bottom 0.305: IC6.2 111.76,38.74 110.17,40.32 R63.2
N$50
  Bottom 0.305: IC6.3 113.03,40 112.71,40.32 R64.2
N$51
  Bottom 0.305: IC6.4 114.3,38.74 115.25,39.69 R65.2
N$52
  Bottom 0.305: IC6.5 115.57,38.1 117.79,40.32 R66.2
N$53
  Bottom 0.305: IC6.6 116.84,38.1 117.79,39.05 120.02,39.05 120.65,39.69 120.65,41.28 R67.2
N$54
  Bottom 0.305: R68.2 122.87,39.69 121.6,38.42 119.06,38.42 118.11,37.46 IC6.7
N$55  (via drill 0.5 pad 1.7)
  Top 0.305: 105.09,33.34 107.63,30.8 v107.63,27.3
  Top 0.406: 105.09,33.34 v105.09,33.97
  Bottom 0.305: v105.09,33.97 R61.2 | v107.63,27.3 110.81,27.3
  Bottom 0.406: 110.81,27.3 111.44,27.94 111.44,28.89 111.76,29.21 IC6.15
N$56
  Bottom 0.305: IC7.1 130.81,37.46 127.95,40.32 R70.2
N$57
  Bottom 0.305: IC7.2 132.08,38.74 130.49,40.32 R71.2
N$58
  Bottom 0.305: IC7.3 133.35,41.28 R72.2
N$59
  Bottom 0.305: IC7.4 134.62,39.37 135.57,40.32 R73.2
N$60
  Bottom 0.305: IC7.5 135.89,38.42 138.11,40.64 R74.2
N$61
  Bottom 0.305: IC7.6 137.16,38.1 138.75,39.69 140.02,39.69 140.65,40.32 R75.2
N$62
  Bottom 0.305: IC7.7 138.43,37.78 139.38,38.74 141.92,38.74 143.19,40 R76.2
N$63  (via drill 0.5 pad 1.7)
  Top 0.305: v123.83,37.46 123.83,30.8 124.46,30.16 v126.68,30.16
  Bottom 0.305: v126.68,30.16 127.95,30.16 129.22,28.89 129.86,28.89 130.49,28.26 131.76,28.26 132.08,28.57 IC7.15 | R69.2 125.41,39.05 v123.83,37.46
N$64  (via drill 0.5 pad 1.7)
  Top 0.305: v145.1,29.85 v145.1,35.88
  Bottom 0.305: v145.1,35.88 145.73,36.51 R77.2
  Bottom 0.406: IC8.15 152.4,27.62 152.08,27.3 145.41,27.3 145.1,27.62 v145.1,29.85
N$65
  Bottom 0.305: IC8.1 151.13,37.46 148.27,40.32 R78.2
N$66
  Bottom 0.305: IC8.2 152.4,39.37 150.81,40.96 R79.2
N$67
  Bottom 0.305: IC8.3 153.67,41.28 R80.2
N$68
  Bottom 0.305: IC8.4 154.94,39.05 155.89,40 R81.2
N$69
  Bottom 0.305: IC8.5 156.21,38.1 158.43,40.32 R82.2
N$70
  Bottom 0.305: IC8.6 157.48,38.1 158.43,39.05 160.02,39.05 160.97,40 R83.2
N$71
  Bottom 0.305: IC8.7 158.75,37.78 159.38,38.42 161.93,38.42 163.19,39.69 R84.2
N$72
  Top 0.305: SV1.63 SV2.1
N$73
  Top 0.305: SV1.61 79.69,46.67 84.77,46.67 SV2.3
N$74
  Top 0.305: SV1.59 77.15,44.13 87.31,44.13 SV2.5
N$75
  Top 0.305: SV1.57 73.66,45.4 75.56,43.5 89.22,43.5 SV2.7
N$76
  Top 0.305: SV1.55 73.34,42.86 91.12,42.86 SV2.9
N$77
  Top 0.305: SV1.53 71.75,42.23 92.71,42.23 96.2,45.72 SV2.11
N$78
  Top 0.305: SV1.51 69.53,41.59 94.61,41.59 98.74,45.72 SV2.13
N$79
  Top 0.305: SV1.49 67.63,40.96 96.84,40.96 SV2.15
N$80
  Top 0.305: SV1.47 60.64,44.13 64.45,40.32 98.74,40.32 SV2.17
N$81
  Top 0.305: SV1.45 58.1,44.45 62.87,39.69 100.65,39.69 SV2.19
N$82
  Top 0.305: SV1.43 55.56,44.13 60.64,39.05 102.55,39.05 SV2.21
N$83
  Top 0.305: SV1.41 53.02,44.77 59.37,38.42 104.78,38.42 111.44,45.09 SV2.23
N$84
  Top 0.305: SV1.39 50.48,45.09 57.78,37.78 106.68,37.78 113.98,45.09 SV2.25
N$85
  Top 0.305: SV1.37 56.2,37.15 108.9,37.15 116.52,44.77 SV2.27
N$86
  Top 0.305: SV2.29 119.06,45.09 110.49,36.51 54.29,36.51 SV1.35
N$87
  Top 0.305: SV2.31 121.6,45.09 112.39,35.88 51.75,35.88 42.86,44.77 SV1.33
N$88
  Top 0.25: IC13.3 63.49,16.5 63.82,16.83 65.41,16.83
  Top 0.305: 65.41,16.83 66.67,18.1 Q2.2
N$89
  Top 0.25: IC13.4 62.99,16.95 63.5,17.46
  Top 0.305: 63.5,17.46 64.14,18.1 Q2.1
N$90
  Top 0.25: IC13.5 62.49,19.31 62.87,19.69 62.87,23.49 63.5,24.13
  Top 0.305: 63.5,24.13 66.23,26.86 Q1.2
  Bottom 0.305: Q1.2 66.04,30.04 C9.1
N$91
  Top 0.25: IC13.6 61.99,20.4
  Top 0.305: 61.28,27.62 61.28,29.72 Q1.1
  Top 0.406: 61.99,20.4 61.99,26.91 61.28,27.62
  Bottom 0.305: Q1.1 61.28,29.97 C10.1
N$92
  Bottom 0.406: SV1.18 23.81,46.67 R28.2
N$93
  Bottom 0.406: SV1.20 26.35,46.67 R29.2
N$94
  Bottom 0.406: SV1.22 28.89,46.67 R30.2
N$95
  Bottom 0.406: SV1.24 31.43,46.67 R31.2
N$96
  Bottom 0.406: SV1.26 33.97,46.67 R32.2
N$97
  Bottom 0.406: SV1.28 36.51,46.67 R33.2
N$98
  Bottom 0.406: SV1.30 39.05,46.67 R34.2
N$99
  Bottom 0.406: SV1.32 41.59,46.67 R35.2
N$100
  Bottom 0.406: SV1.34 44.13,46.67 R36.2
N$101
  Bottom 0.406: SV1.36 46.67,46.67 R37.2
N$102
  Bottom 0.406: SV1.38 49.21,46.67 R38.2
N$103
  Bottom 0.406: SV1.40 51.75,46.67 R40.2
N$104
  Bottom 0.406: SV1.42 54.29,46.67 R41.2
N$105
  Bottom 0.406: SV1.44 56.83,46.67 R42.2
N$106
  Bottom 0.406: SV1.46 59.37,46.67 R43.2
N$107
  Bottom 0.406: SV1.48 61.91,46.67 R44.2
N$108
  Bottom 0.406: SV1.50 64.45,46.67 R45.2
N$109
  Bottom 0.406: SV1.52 66.99,46.67 R46.2
N$110
  Bottom 0.406: SV1.54 69.53,46.67 R47.2
N$111
  Bottom 0.406: SV1.56 72.07,46.67 R48.2
N$112
  Bottom 0.406: SV1.58 74.61,46.67 R49.2
N$113
  Bottom 0.406: SV1.60 77.15,46.67 R50.2
N$114
  Bottom 0.406: SV1.62 79.69,46.67 R51.2
N$115
  Bottom 0.406: SV1.64 82.23,46.67 R52.2
N$116
  Bottom 0.406: SV2.2 84.77,46.67 R53.1
N$117
  Bottom 0.406: SV2.4 87.31,46.67 R54.1
N$118
  Bottom 0.406: SV2.6 89.85,46.67 R55.1
N$119  (via drill 0.5 pad 1.7)
  Top 0.3: v63.5,26.35 63.5,32.7 v63.82,33.02
  Bottom 0.3: IC4.15 72.39,29.53 71.12,28.26 65.41,28.26 v63.5,26.35
  Bottom 0.305: v63.82,33.02 63.82,40.96 R45.1
N$120
  Bottom 0.305: IC4.1 71.12,36.83 66.99,40.96 R46.1
N$121
  Bottom 0.305: IC4.2 72.39,38.1 69.53,40.96 R47.1
N$122
  Bottom 0.305: IC4.3 73.66,40.01 R48.1
N$123
  Bottom 0.305: IC4.4 74.93,41.28 R49.1
N$124
  Bottom 0.305: IC4.5 76.2,39.05 77.15,40 R50.1
N$125
  Bottom 0.305: IC4.6 77.47,38.1 79.69,40.32 R51.1
N$126
  Bottom 0.305: IC4.7 78.74,37.78 80.01,39.05 80.96,39.05 82.23,40.32 R52.1
N$127
  Bottom 0.406: SV2.8 92.39,46.67 R56.1
N$128
  Bottom 0.406: SV2.10 94.93,46.67 R57.1
N$129
  Bottom 0.406: SV2.12 97.47,46.67 R58.1
N$130
  Bottom 0.406: SV2.14 100.01,46.67 R59.1
N$131
  Bottom 0.406: SV2.16 102.55,46.67 R60.1
N$132
  Bottom 0.406: SV2.18 105.09,46.67 R61.1
N$133
  Bottom 0.406: SV2.20 107.63,46.67 R62.1
N$134
  Bottom 0.406: SV2.22 110.17,46.67 R63.1
N$135
  Bottom 0.406: SV2.24 112.71,46.67 R64.1
N$136
  Bottom 0.406: SV2.26 115.25,46.67 R65.1
N$137
  Bottom 0.406: SV2.28 117.79,46.67 R66.1
N$138
  Bottom 0.406: SV2.30 120.33,46.67 R67.1
N$139
  Top 0.305: R1.2 T1.1
N$140
  Top 0.254: R17.1 R18.1 76.2,14.6 73.57,11.98 IC13.44
N$141
  Top 0.305: R2.2 3.81,29.53 T2.1
N$142
  Top 0.305: R3.2 7.3,32.7 6.35,33.65 T3.1
N$143
  Top 0.305: R4.2 T4.1
N$144
  Top 0.305: R5.2 12.38,32.7 11.43,33.65 T5.1
N$145
  Top 0.305: R6.2 T6.1
N$146
  Top 0.305: R7.2 16.51,33.02 T7.1
N$147
  Top 0.305: R8.2 T8.1
N$148
  Top 0.305: R9.2 22.54,32.39 21.59,33.34 T9.1
N$149
  Top 0.305: R10.2 T10.1
N$150
  Top 0.305: R11.2 27.62,32.39 26.67,33.34 T11.1
N$151
  Top 0.305: R12.2 T12.1
N$152
  Top 0.305: R13.2 32.7,32.39 31.75,33.34 T13.1
N$153
  Top 0.305: R14.2 T14.1
N$154
  Top 0.305: R15.2 37.78,32.39 36.83,33.34 T15.1
N$155
  Top 0.305: R16.2 T16.1
N$156  (via drill 0.5 pad 4)
  other vias: 161.93,2.86
N$158
  Bottom 0.406: SV2.32 122.87,46.67 R68.1
N$159
  Bottom 0.406: SV2.34 125.41,46.67 R69.1
N$160
  Bottom 0.406: SV2.36 127.95,46.67 R70.1
N$161
  Bottom 0.406: SV2.38 130.49,46.67 R71.1
N$162
  Bottom 0.406: SV2.40 133.03,46.67 R72.1
N$163
  Bottom 0.406: SV2.42 135.57,46.67 R73.1
N$164
  Bottom 0.406: SV2.44 138.11,46.67 R74.1
N$165
  Bottom 0.406: SV2.46 140.65,46.67 R75.1
N$166
  Bottom 0.406: SV2.48 143.19,46.67 R76.1
N$167
  Bottom 0.406: SV2.50 145.73,46.67 R77.1
N$168
  Bottom 0.406: SV2.52 148.27,46.67 R78.1
N$169
  Bottom 0.406: SV2.54 150.81,46.67 R79.1
N$170
  Bottom 0.406: SV2.56 153.35,46.67 R80.1
N$171
  Bottom 0.406: SV2.58 155.89,46.67 R81.1
N$172
  Bottom 0.406: SV2.60 158.43,46.67 R82.1
N$173
  Bottom 0.406: SV2.62 160.97,46.67 R83.1
N$174
  Bottom 0.406: SV2.64 163.51,46.67 163.51,44.13 163.19,43.82 R84.1
NRST
  Top 0.254: IC13.7 61.49,19.05
  Top 0.305: 61.49,19.05 R19.1
OE  (via drill 0.5 pad 1.7)
  Top 0.254: IC13.29 60.99,4.48 60.33,3.81 37.78,3.81
  Top 0.305: v154.62,19.37 v154.62,25.72 | v133.67,19.37 v133.67,26.03 | v93.66,27.94 93.03,27.3 v93.03,19.05 | 37.78,3.81 25.72,3.81 v24.77,4.76
  Top 0.406: v20.64,25.4 19.05,23.81 17.46,23.81 14.61,20.96 v14.61,20.64 | v52.7,27.3 53.02,27.3 51.12,25.4 v51.12,20 | v74.61,27.94 72.39,25.72 v72.39,19.05 | v112.39,19.05 112.39,26.35 v113.98,27.94
  Bottom 0.305: 11.75,29.21 IC1.13 | IC4.13 74.93,28.26 v74.61,27.94 | IC5.13 93.98,28.26 v93.66,27.94 | v154.62,19.37 v133.67,19.37 114.62,19.37 | IC6.13 114.3,28.26 v113.98,27.94
  Bottom 0.4: v24.77,4.76 28.57,4.76 33.02,9.21 33.02,13.97 39.05,20 v51.12,20 53.02,18.1 71.44,18.1 v72.39,19.05 | IC7.13 134.62,29.21 134.3,28.89 134.3,26.67 v133.67,26.03 | IC8.13 154.94,28.89 154.62,28.57 v154.62,25.72
  Bottom 0.406: IC2.13 34.29,27.94 32.7,26.35 21.59,26.35 v20.64,25.4 | 11.75,29.21 11.75,23.81 14.61,20.96 v14.61,20.64 24.77,10.48 v24.77,4.76 | 114.62,19.37 112.71,19.37 v112.39,19.05 v93.03,19.05 v72.39,19.05 | v52.7,27.3 53.34,27.94 IC3.13
PHOTO  (via drill 0.5 pad 1.7)
  Top 0.305: SL2.1 R39.1 | 52.85,15.41 IC13.12
  Top 0.4: 52.85,15.41 52.7,15.56 v51.12,15.56
  Bottom 0.305: 52.7,3.49 54.61,1.59 67.94,1.59
  Bottom 0.4: v51.12,15.56 52.7,13.97 52.7,3.49 | 67.94,1.59 85.41,1.59 86.36,2.54 SL2.1
RI1
  Top 0.406: T1.3 SV1.1
RI2
  Top 0.406: T2.3 SV1.3
RI3
  Top 0.406: T3.3 SV1.5
RI4
  Top 0.406: T4.3 SV1.7
RI5
  Top 0.406: T5.3 SV1.9
RI6
  Top 0.406: T6.3 SV1.11
RI7
  Top 0.406: T7.3 SV1.13
RI8
  Top 0.406: T8.3 SV1.15
RI9
  Top 0.406: T9.3 SV1.17
RI10
  Top 0.305: T10.3 25.08,34.92 26.35,36.2 26.35,37.47
  Top 0.406: 26.35,37.47 26.35,44.13 SV1.19
RI11
  Top 0.406: T11.3 SV1.21
RI12
  Top 0.406: T12.3 SV1.23
RI13
  Top 0.406: T13.3 SV1.25
RI14
  Top 0.406: T14.3 SV1.27
RI15
  Top 0.406: T15.3 SV1.29
RI16
  Top 0.406: T16.3 SV1.31
RXD
  Top 0.25: IC13.43 78.15,11.48 78.26,11.59
  Top 0.4: IC9.1 99.06,8.89 89.85,8.89 87.15,11.59 78.26,11.59
STCP  (via drill 0.5 pad 1.7)
  Top 0.254: IC13.45 71.85,12.48 74.61,15.24
  Top 0.305: v95.25,21.59 v95.25,26.67 | v156.21,21.27 v156.21,27.62 | v135.89,21.27 v135.89,27.62
  Top 0.328: 74.61,15.24 74.61,20.32 v76.2,21.59
  Top 0.406: v16.83,20.64 18.73,22.54 20.32,22.54 21.59,23.81 v22.23,23.81 | v54.61,25.72 54.29,25.4 v54.29,20.96 | v76.2,21.59 v76.2,26.67 | v115.57,21.59 v115.57,26.67
  Bottom 0.305: 13.02,29.53 IC1.12 | v54.61,25.72 IC3.12 | v76.2,26.67 IC4.12 | v95.25,26.67 IC5.12 | v156.21,27.62 IC8.12 | v135.89,27.62 IC7.12 | v156.21,21.27 v135.89,21.27 135.57,21.59 v115.57,21.59 v95.25,21.59 | v115.57,26.67 IC6.12
  Bottom 0.4: 13.02,27.94 13.02,24.45 14.92,22.54 | 28.57,7.3 31.75,10.48 31.75,14.6 39.05,21.91 53.34,21.91 v54.29,20.96 56.2,19.05 68.58,19.05 71.12,21.59 v76.2,21.59
  Bottom 0.406: 13.02,27.94 13.02,29.53 | IC2.12 35.56,27.3 33.34,25.08 23.5,25.08 v22.23,23.81 | 14.92,22.54 v16.83,20.64 26.35,11.11 26.35,8.57 27.62,7.3 28.57,7.3 | v76.2,21.59 v95.25,21.59
SWDCLK
  Top 0.254: IC13.37 73.44,8.48 76.2,5.71
  Top 0.328: 76.2,5.71 SL1.2
SWDIO
  Top 0.254: IC13.34 63.49,5.71 63.18,5.4 63.18,3.18 63.5,2.86
  Top 0.305: 63.5,2.86 65.09,1.27 70.8,1.27
  Top 0.328: 70.8,1.27 72.07,1.27 73.66,2.86 SL1.3
TXD  (via drill 0.5 pad 1.7)
  Top 0.25: IC13.42 74.75,10.98 76.52,9.21
  Top 0.4: IC9.8 92.08,15.24 89.85,13.02 v89.22,12.38 | 76.52,9.21 85.09,9.21 v85.41,9.52
  Bottom 0.4: v85.41,9.52 86.36,9.52 v89.22,12.38

### Text on the board
Top: TOP
Bottom: BOTTOM